# EAGLE schematic Yocto v2.007 (EAGLE 6.1), part 2 of 3
## Sheet 11 of 18: HT
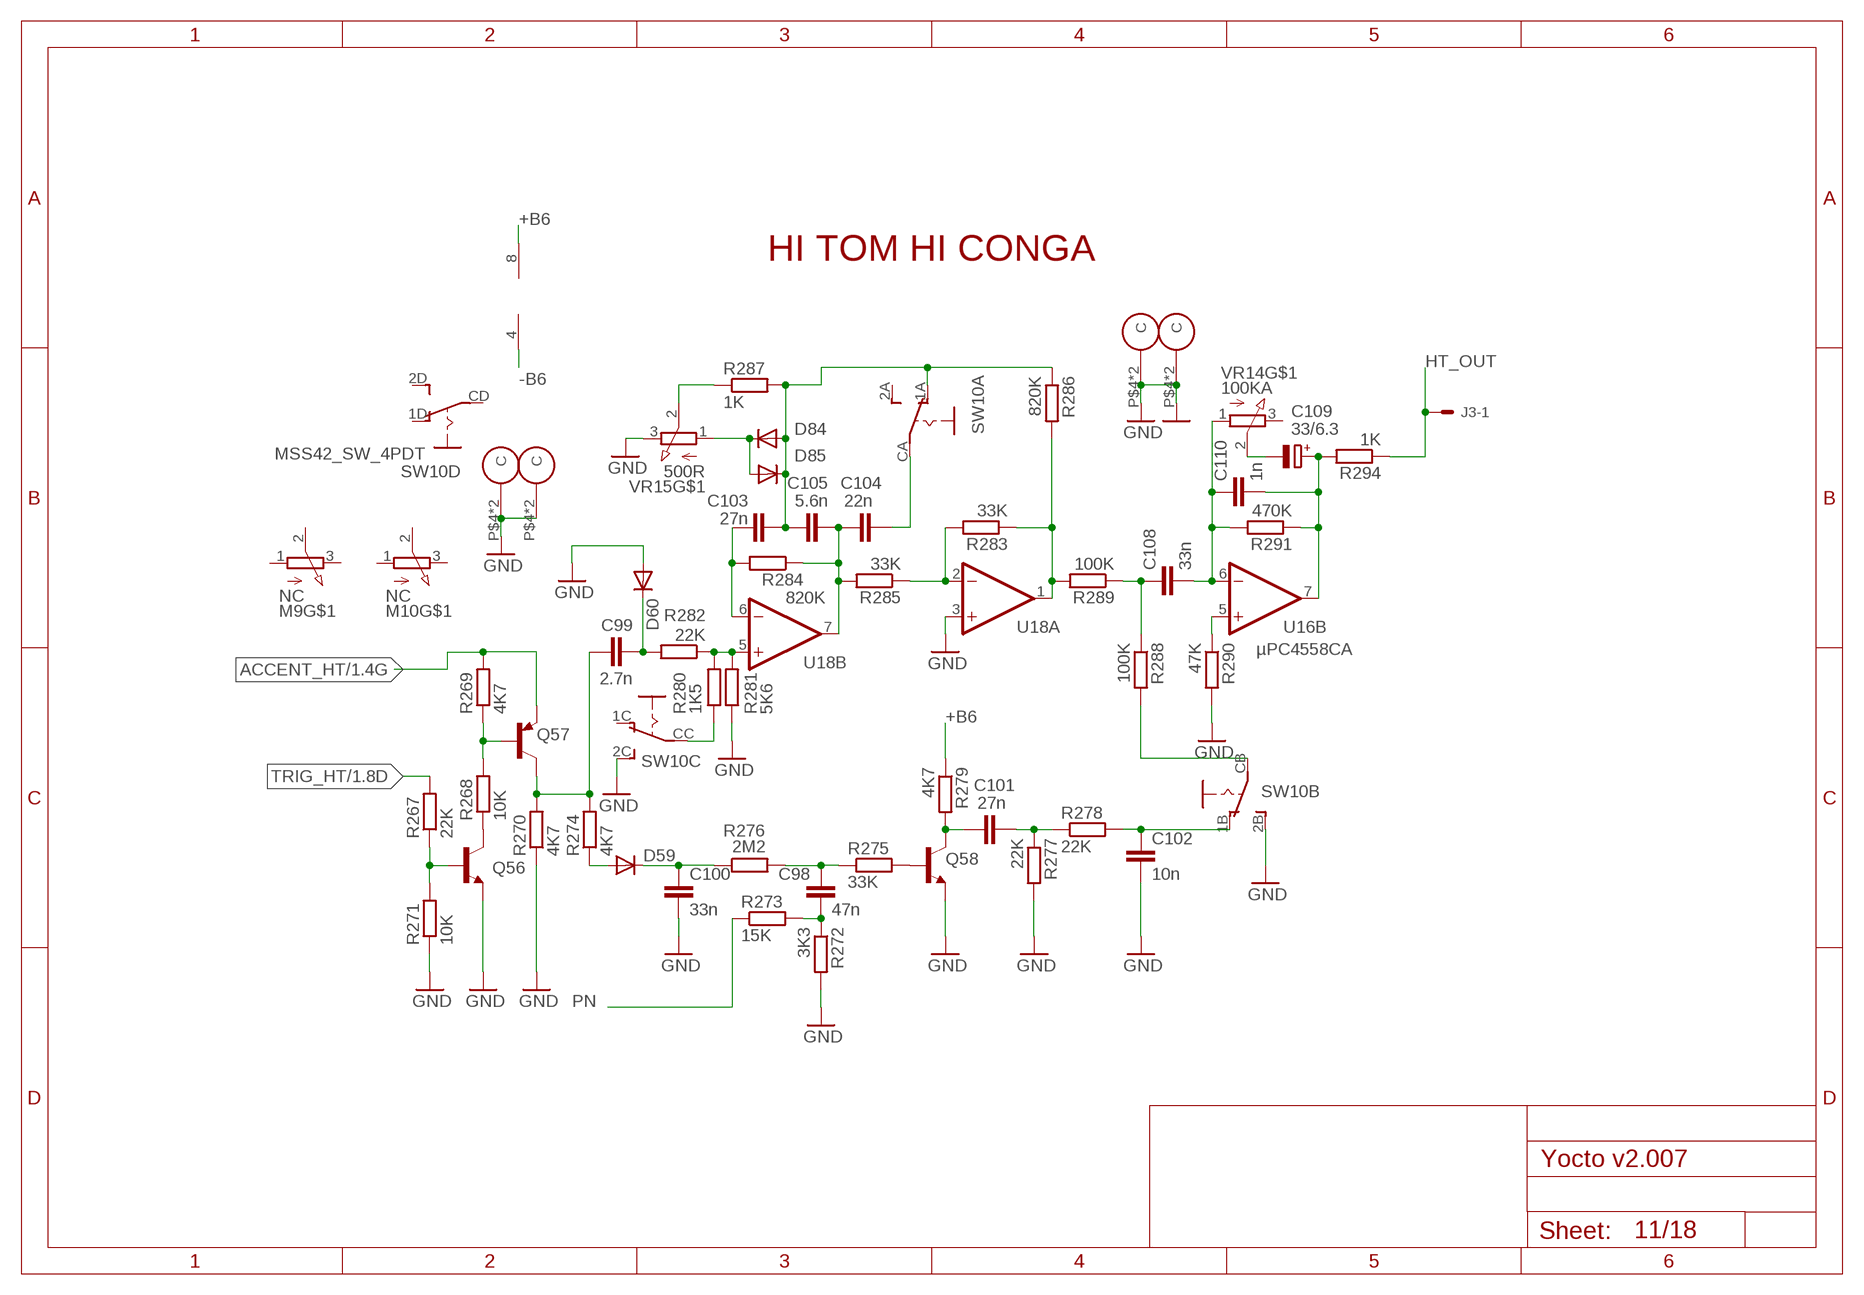
[diagram p11: schematic, sheet 11]

### Parts
C98  47n  C-EU050-025X075  [C050-025X075]
C99  2.7n  C-EU050-025X075  [C050-025X075]
C100  33n  C-EU050-025X075  [C050-025X075]
C101  27n  C-EU050-025X075  [C050-025X075]
C102  10n  C-EU050-025X075  [C050-025X075]
C103  27n  C-EU050-025X075  [C050-025X075]
C104  22n  C-EU050-025X075  [C050-025X075]
C105  5.6n  C-EU050-025X075  [C050-025X075]
C108  33n  C-EU050-025X075  [C050-025X075]
C109  33/6.3  CPOL-EUE2-5  [E2-5]
C110  1n  C-EU050-025X075  [C050-025X075]
D59  1N4148  [DO35-7C]
D60  1N4148  [DO35-7C]
D84  1N34  1N4148  [DO35-7C]
D85  1N34  1N4148  [DO35-7C]
J3  22-27-2041-04  [6410-04]
M9  NC  POT_8089MM  [R0903N]
M10  NC  POT_8089MM  [R0903N]
Q56  2SC945  [TO-92-ECB-PERSO]
Q57  2SA733  [TO-92-ECB-MARKED]
Q58  2SC945  [TO-92-ECB-PERSO]
R267  22K  R-EU_0207/7  [0207/7]
R268  10K  R-EU_0207/7  [0207/7]
R269  4K7  R-EU_0207/7  [0207/7]
R270  4K7  R-EU_0207/7  [0207/7]
R271  10K  R-EU_0207/7  [0207/7]
R272  3K3  R-EU_0207/7  [0207/7]
R273  15K  R-EU_0207/7  [0207/7]
R274  4K7  R-EU_0207/7  [0207/7]
R275  33K  R-EU_0207/7  [0207/7]
R276  2M2  R-EU_0207/7  [0207/7]
R277  22K  R-EU_0207/7  [0207/7]
R278  22K  R-EU_0207/7  [0207/7]
R279  4K7  R-EU_0207/7  [0207/7]
R280  1K5  R-EU_0207/7  [0207/7]
R281  5K6  R-EU_0207/7  [0207/7]
R282  22K  R-EU_0207/7  [0207/7]
R283  33K  R-EU_0207/7  [0207/7]
R284  820K  R-EU_0207/7  [0207/7]
R285  33K  R-EU_0207/7  [0207/7]
R286  820K  R-EU_0207/7  [0207/7]
R287  1K  R-EU_0207/7  [0207/7]
R288  100K  R-EU_0207/7  [0207/7]
R289  100K  R-EU_0207/7  [0207/7]
R290  47K  R-EU_0207/7  [0207/7]
R291  470K  R-EU_0207/7  [0207/7]
R294  1K  R-EU_0207/7  [0207/7]
SW10  MSS42_SW_4PDT  [MSS42_SW_SLIDE]
U18  µPC4558CA  [DIL08]
VR14  100KA  POT_8089MM  [R0903N]
VR15  500R  POT_8089MM  [R0903N]

### Nets
+B6 [power]: R279.1 U18.8(V+) ; also sheet 4
-B6 [power]: U18.4(V-) ; also sheet 4
ACCENT_HT: Q57.E R269.2 ; also sheet 1
GND [GND]: C100.2 C102.2 D60.A M9.P$4(C) M9.P$5(C) M10.P$4(C) M10.P$5(C) Q56.E Q58.E R270.1 R271.1 R272.2 R277.2 R281.1 R290.2 SW10.2B(B:S) SW10.2C(C:S) SW10.P$1(GND) SW10.P$2(GND) SW10.P$3(GND) SW10.P$4(GND) U18.3(A:+IN) VR14.P$4(C) VR14.P$5(C) VR15.3(E) VR15.P$4(C) VR15.P$5(C) ; also sheet 1,2,3,4,5,6,7,8,9,10,12,13,14,15,16,17,18
HT_OUT: J3.1 R294.1
N$141: Q57.B R268.2 R269.1
N$142: Q56.C R268.1
N$143: Q56.B R267.1 R271.2
N$144: C99.1 Q57.C R270.2 R274.2
N$145: D59.A R274.1
N$146: C99.2 D60.C R282.2
N$147 [special]: C103.2 C105.1 D84.A D85.C R286.1 R287.2 SW10.1A(A:O)
N$148: C103.1 R284.2 U18.6(B:-IN)
N$149: C104.1 C105.2 R284.1 R285.2 U18.7(B:OUT)
N$150: D84.C D85.A VR15.1(A)
N$151: R287.1 VR15.2(S)
N$152: R283.2 R285.1 U18.2(A:-IN)
N$153 [special]: R283.1 R286.2 R289.2 U18.1(A:OUT)
N$154: C108.1 R288.1 R289.1
N$155: C108.2 C110.1 R291.2 U16.6(B:-IN) VR14.1(A)
N$156: C109.- VR14.2(S)
N$157: C109.+ C110.2 R291.1 R294.2 U16.7(B:OUT)
N$158: C101.1 Q58.C R279.2
N$161: C102.1 R278.2 SW10.1B(B:O)
N$162: Q58.B R275.2
N$165: C98.2 R272.1 R273.2
N$167: C98.1 R275.1 R276.2
N$168: C100.1 D59.C R276.1
N$169: C104.2 SW10.CA(A:P)
N$170: R288.2 SW10.CB(B:P)
N$171: C101.2 R277.1 R278.1
N$172: R290.1 U16.5(B:+IN)
N$173: R280.2 R281.2 R282.1 U18.5(B:+IN)
N$174: R280.1 SW10.CC(C:P)
PN: R273.1 ; also sheet 6,9,10
TRIG_HT: R267.2 ; also sheet 1
Unconnected: M9.1(A) M9.2(S) M9.3(E) M10.1(A) M10.2(S) M10.3(E) SW10.1C(C:O) SW10.1D(D:O) SW10.2A(A:S) SW10.2D(D:S) SW10.CD(D:P) VR14.3(E)

### Notes on the sheet
- HI TOM HI CONGA

## Sheet 12 of 18: RM
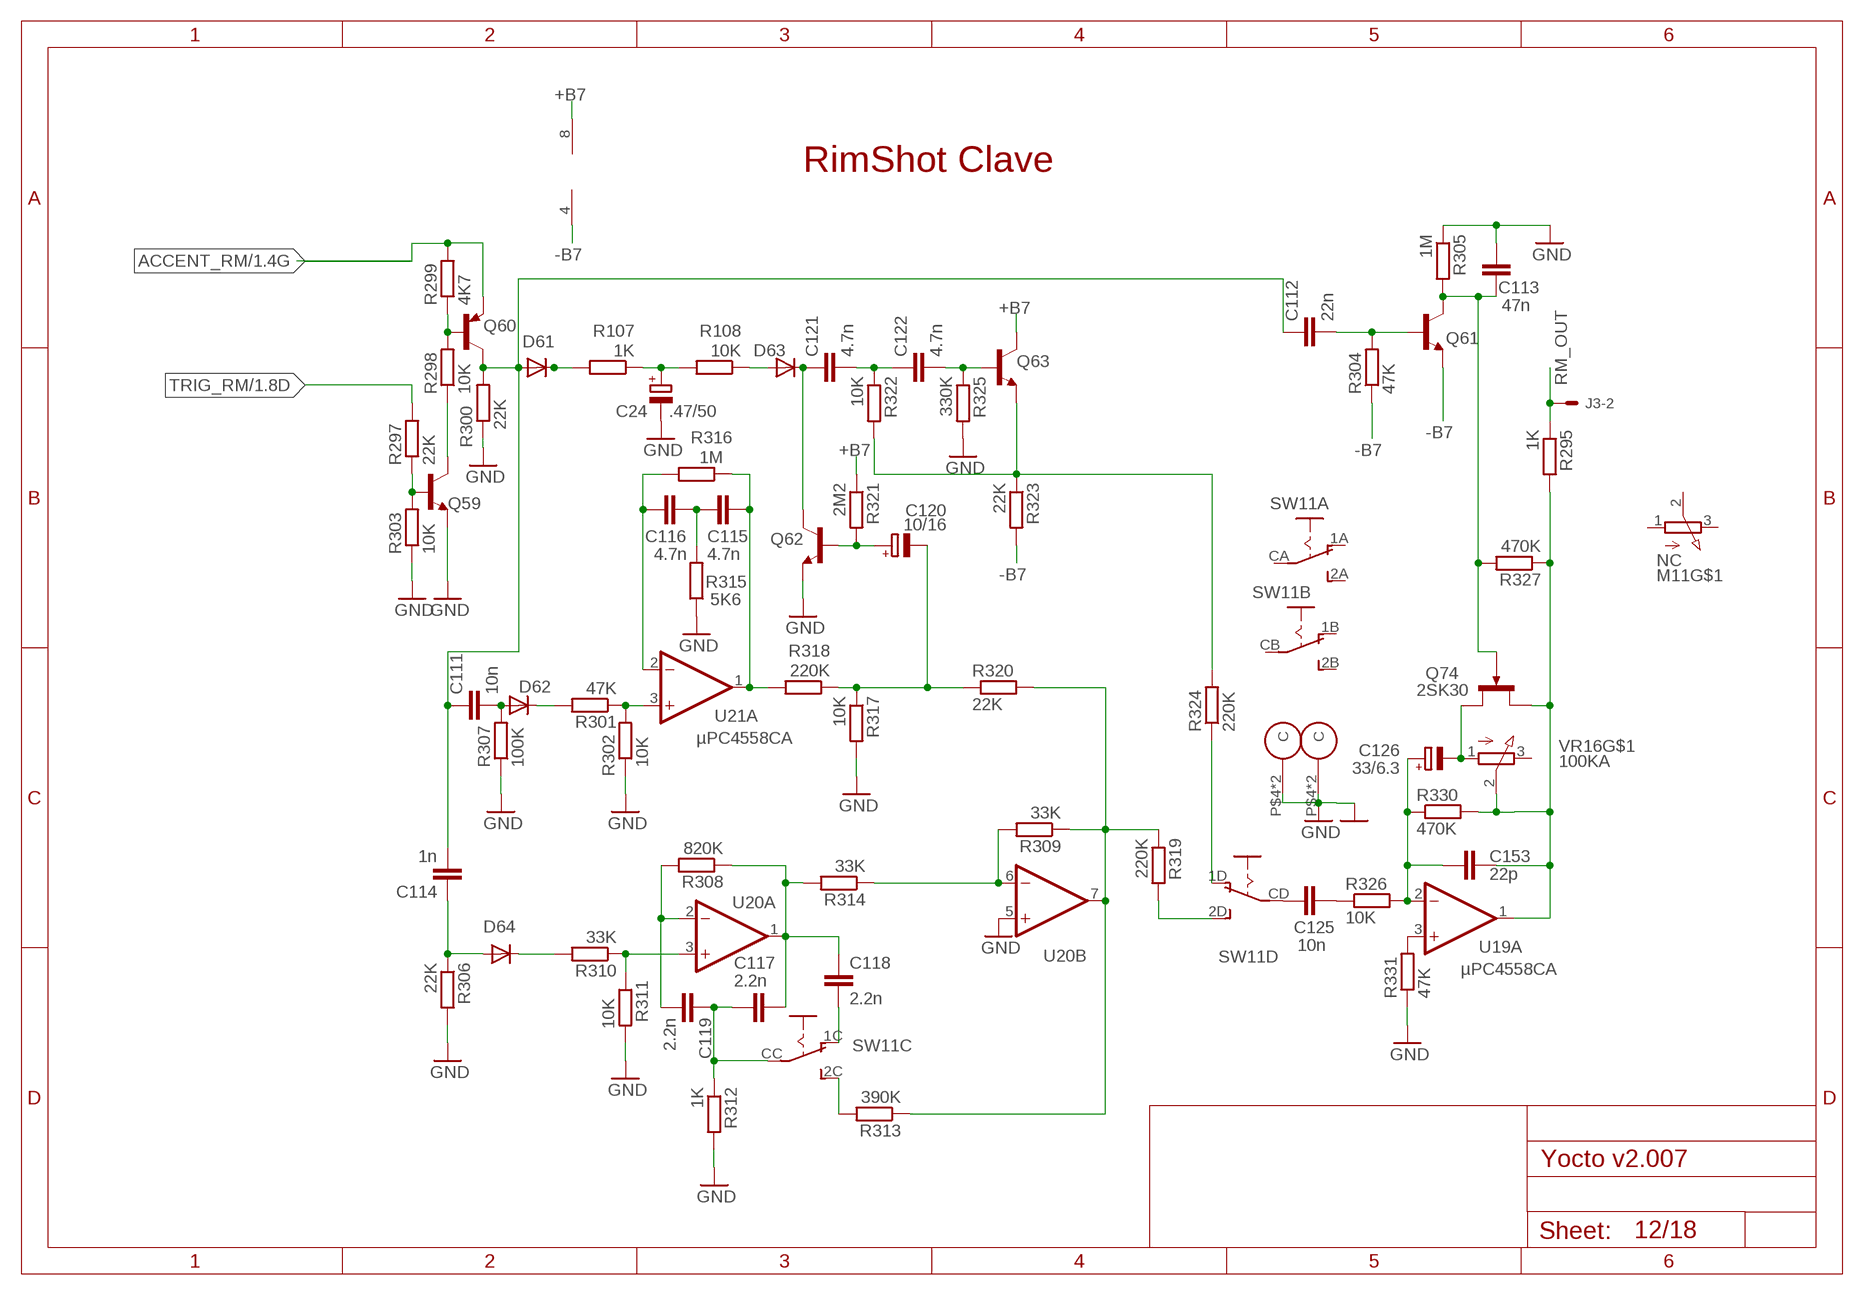
[diagram p12: schematic, sheet 12]

### Parts
C24  .47/50  CPOL-EUE2-5  [E2-5]
C111  10n  C-EU050-025X075  [C050-025X075]
C112  22n  C-EU050-025X075  [C050-025X075]
C113  47n  C-EU050-025X075  [C050-025X075]
C114  1n  C-EU050-025X075  [C050-025X075]
C115  4.7n  C-EU050-025X075  [C050-025X075]
C116  4.7n  C-EU050-025X075  [C050-025X075]
C117  2.2n  C-EU050-025X075  [C050-025X075]
C118  2.2n  C-EU050-025X075  [C050-025X075]
C119  2.2n  C-EU050-025X075  [C050-025X075]
C120  10/16  CPOL-EUE2-5  [E2-5]
C121  4.7n  C-EU050-025X075  [C050-025X075]
C122  4.7n  C-EU050-025X075  [C050-025X075]
C125  10n  C-EU050-025X075  [C050-025X075]
C126  33/6.3  CPOL-EUE2-5  [E2-5]
C153  22p  C-EU025-025X050  [C025-025X050]
D61  1N4148  [DO35-7C]
D62  1N4148  [DO35-7C]
D63  1N4148  [DO35-7C]
D64  1N4148  [DO35-7C]
M11  NC  POT_8089MM  [R0903N]
Q59  2SC945  [TO-92-ECB-PERSO]
Q60  2SA733  [TO-92-ECB-MARKED]
Q61  2SC945  [TO-92-ECB-PERSO]
Q62  2SC945  [TO-92-ECB-PERSO]
Q63  2SC945  [TO-92-ECB-PERSO]
Q74  2SK30  [TO-92-MARKED_FET]
R107  1K  R-EU_0207/7  [0207/7]
R108  10K  R-EU_0207/7  [0207/7]
R295  1K  R-EU_0207/7  [0207/7]
R297  22K  R-EU_0207/7  [0207/7]
R298  10K  R-EU_0207/7  [0207/7]
R299  4K7  R-EU_0207/7  [0207/7]
R300  22K  R-EU_0207/7  [0207/7]
R301  47K  R-EU_0207/7  [0207/7]
R302  10K  R-EU_0207/7  [0207/7]
R303  10K  R-EU_0207/7  [0207/7]
R304  47K  R-EU_0207/7  [0207/7]
R305  1M  R-EU_0207/7  [0207/7]
R306  22K  R-EU_0207/7  [0207/7]
R307  100K  R-EU_0207/7  [0207/7]
R308  820K  R-EU_0207/7  [0207/7]
R309  33K  R-EU_0207/7  [0207/7]
R310  33K  R-EU_0207/7  [0207/7]
R311  10K  R-EU_0207/7  [0207/7]
R312  1K  R-EU_0207/7  [0207/7]
R313  390K  R-EU_0207/7  [0207/7]
R314  33K  R-EU_0207/7  [0207/7]
R315  5K6  R-EU_0207/7  [0207/7]
R316  1M  R-EU_0207/7  [0207/7]
R317  10K  R-EU_0207/7  [0207/7]
R318  220K  R-EU_0207/7  [0207/7]
R319  220K  R-EU_0207/7  [0207/7]
R320  22K  R-EU_0207/7  [0207/7]
R321  2M2  R-EU_0207/7  [0207/7]
R322  10K  R-EU_0207/7  [0207/7]
R323  22K  R-EU_0207/7  [0207/7]
R324  220K  R-EU_0207/7  [0207/7]
R325  330K  R-EU_0207/7  [0207/7]
R326  10K  R-EU_0207/7  [0207/7]
R327  470K  R-EU_0207/7  [0207/7]
R330  470K  R-EU_0207/7  [0207/7]
R331  47K  R-EU_0207/7  [0207/7]
SW11  MSS42_SW_4PDT  [MSS42_SW_SLIDE]
U19  µPC4558CA  [DIL08]
U20  µPC4558CA  [DIL08]
U21  µPC4558CA  [DIL08]
VR16  100KA  POT_8089MM  [R0903N]

### Nets
+B7 [power]: Q63.C R321.1 U20.8(V+) ; also sheet 4,13
-B7 [power]: Q61.E R304.1 R323.2 U20.4(V-) ; also sheet 4,13
ACCENT_RM: Q60.E R299.2 ; also sheet 1
GND [GND]: C24.- C113.2 M11.P$4(C) M11.P$5(C) Q59.E Q62.E R300.1 R302.1 R303.1 R305.1 R306.2 R307.1 R311.2 R312.2 R315.1 R317.2 R325.2 R331.1 SW11.P$1(GND) SW11.P$2(GND) SW11.P$3(GND) SW11.P$4(GND) U20.5(B:+IN) VR16.P$4(C) VR16.P$5(C) ; also sheet 1,2,3,4,5,6,7,8,9,10,11,13,14,15,16,17,18
N$175: C113.1 Q61.C Q74.G R305.2 R327.2
N$176: C112.2 Q61.B R304.2
N$177: C118.2 SW11.1C(C:O)
N$178: C24.+ R107.1 R108.2
N$179: C153.2 Q74.D R295.2 R327.1 R330.2 U19.1(A:OUT) VR16.2(S)
N$180: C121.1 D63.C Q62.C
N$181: C114.1 D64.A R306.1
N$182: C120.+ Q62.B R321.2
N$183: C111.2 D62.A R307.2
N$184: R331.2 U19.3(A:+IN)
N$185: C125.1 SW11.CD(D:P)
N$306 [special]: R313.2 SW11.2C(C:S)
N$317: Q60.B R298.2 R299.1
N$318: Q59.B R297.1 R303.2
N$319: Q59.C R298.1
N$324: D61.C R107.2
N$326: D63.A R108.1
N$328: C121.2 C122.1 R322.1
N$329: C122.2 Q63.B R325.1
N$330: Q63.E R322.2 R323.1 R324.2
N$332: D62.C R301.2
N$333: R301.1 R302.2 U21.3(A:+IN)
N$336: D64.C R310.2
N$337: R310.1 R311.1 U20.3(A:+IN)
N$338: C117.2 C119.1 R312.1 SW11.CC(C:P)
N$339: C119.2 R308.2 U20.2(A:-IN)
N$340: C117.1 C118.1 R308.1 R314.2 U20.1(A:OUT)
N$343: R309.2 R314.1 U20.6(B:-IN)
N$344: R309.1 R313.1 R319.1 R320.2 U20.7(B:OUT)
N$345: R319.2 SW11.2D(D:S)
N$347: C125.2 R326.1
N$348: C126.+ C153.1 R326.2 R330.1 U19.2(A:-IN)
N$351: C126.- Q74.S VR16.1(A)
N$352: C115.2 C116.1 R315.2
N$353: C116.2 R316.2 U21.2(A:-IN)
N$354: C115.1 R316.1 R318.2 U21.1(A:OUT)
N$355: C120.- R317.1 R318.1 R320.1
N$357: C111.1 C112.1 C114.2 D61.A Q60.C R300.2
N$473: R324.1 SW11.1D(D:O)
RM_OUT: J3.2 R295.1
TRIG_RM: R297.2 ; also sheet 1
Unconnected: M11.1(A) M11.2(S) M11.3(E) SW11.1A(A:O) SW11.1B(B:O) SW11.2A(A:S) SW11.2B(B:S) SW11.CA(A:P) SW11.CB(B:P) VR16.3(E)

### Notes on the sheet
- RimShot Clave

## Sheet 13 of 18: HC
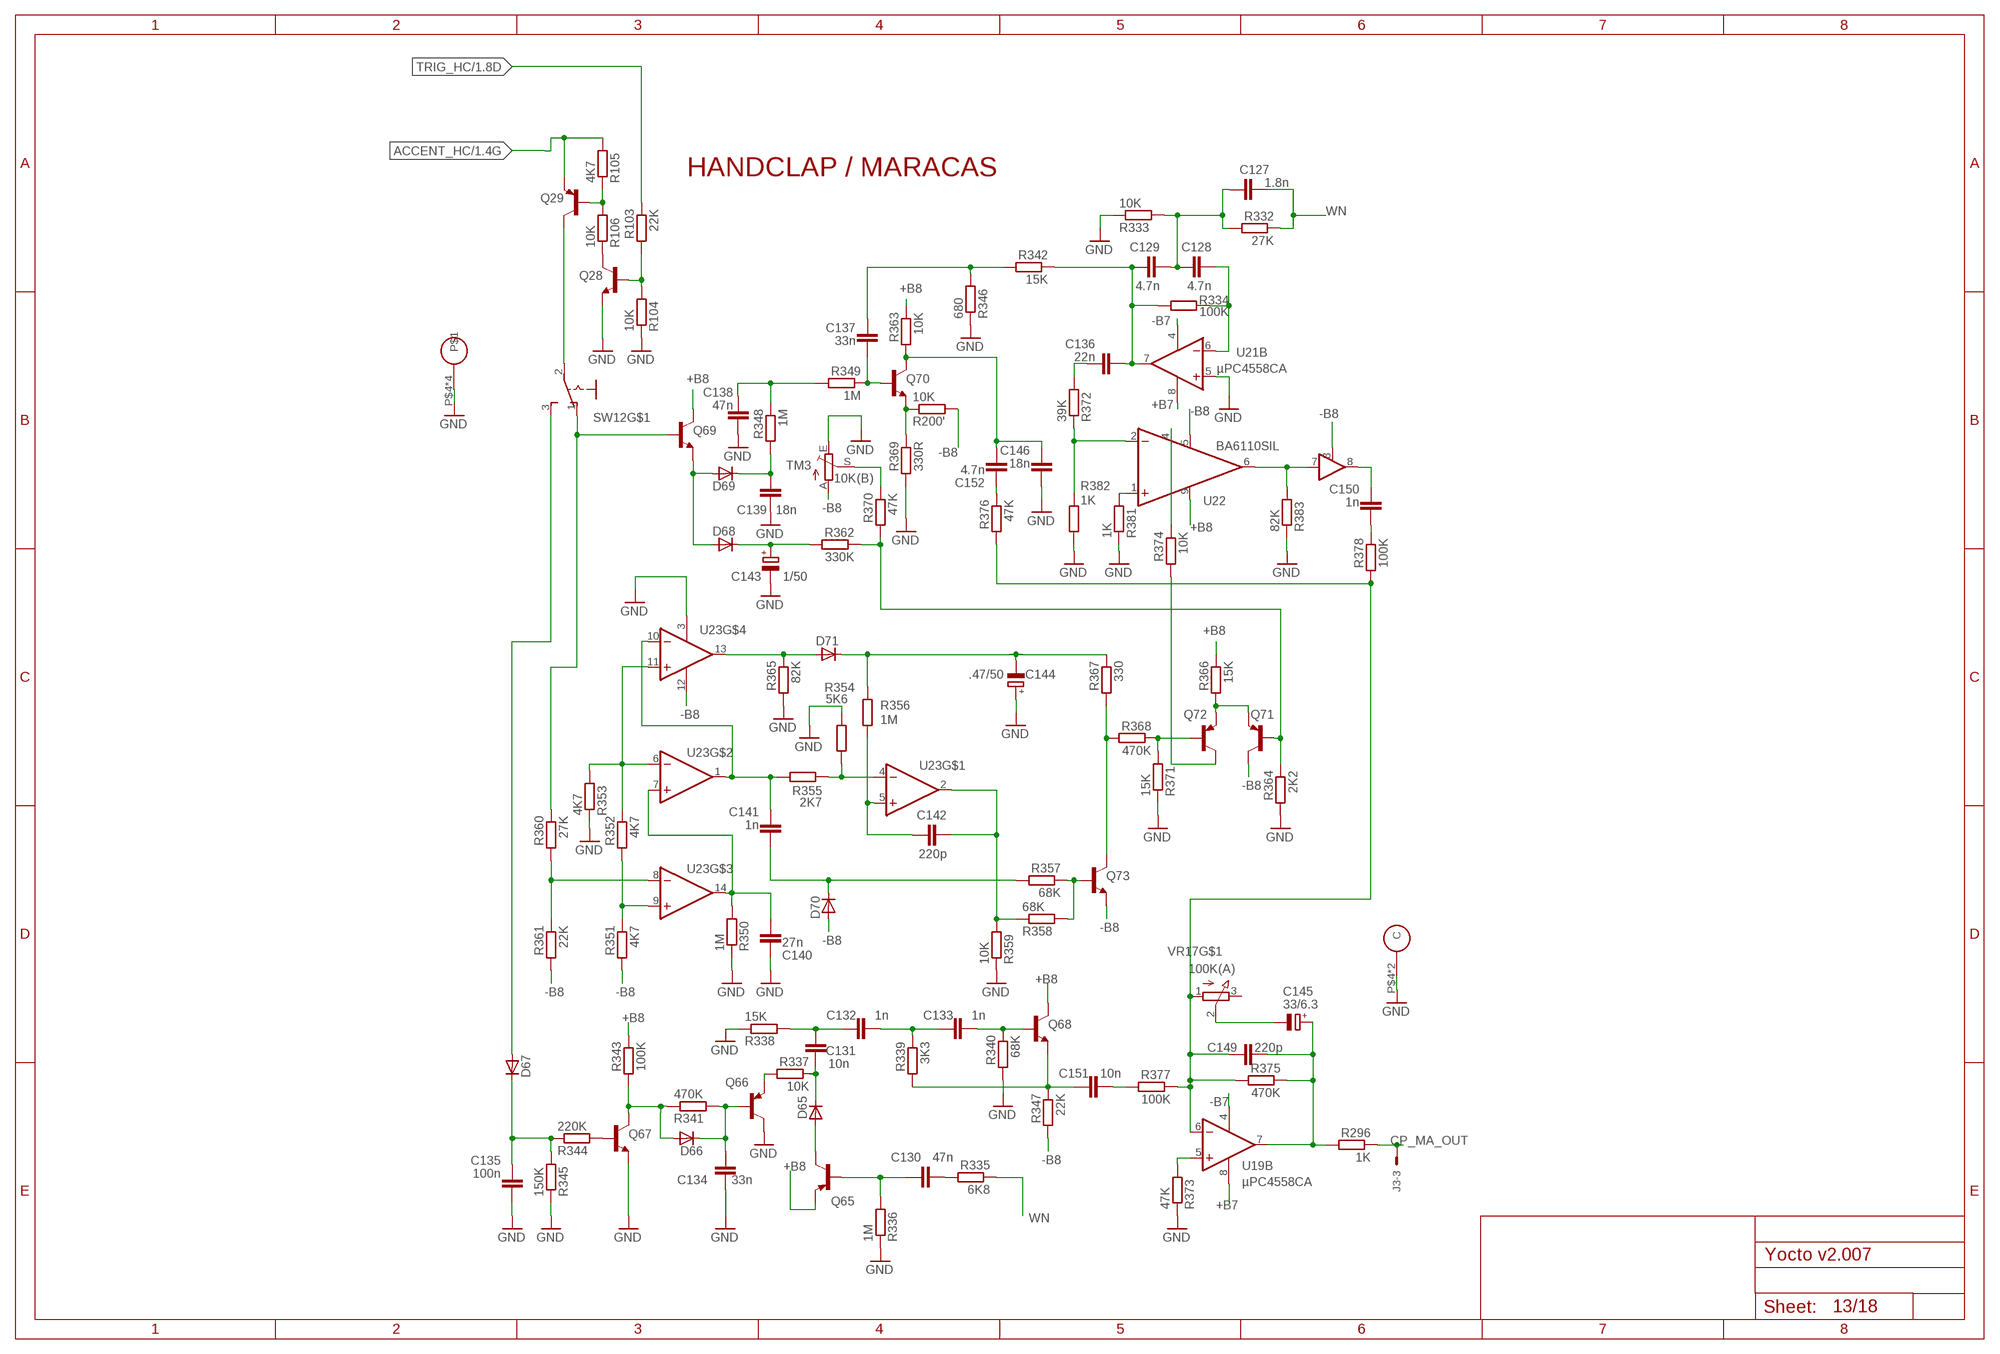
[diagram p13: schematic, sheet 13]

### Parts
C127  1.8n  C-EU050-025X075  [C050-025X075]
C128  4.7n  C-EU050-025X075  [C050-025X075]
C129  4.7n  C-EU050-025X075  [C050-025X075]
C130  47n  C-EU050-025X075  [C050-025X075]
C131  10n  C-EU050-025X075  [C050-025X075]
C132  1n  C-EU050-025X075  [C050-025X075]
C133  1n  C-EU050-025X075  [C050-025X075]
C134  33n  C-EU050-025X075  [C050-025X075]
C135  100n  C-EU050-025X075  [C050-025X075]
C136  22n  C-EU050-025X075  [C050-025X075]
C137  33n  C-EU050-025X075  [C050-025X075]
C138  47n  C-EU050-025X075  [C050-025X075]
C139  18n  C-EU050-025X075  [C050-025X075]
C140  27n  C-EU050-025X075  [C050-025X075]
C141  1n  C-EU050-025X075  [C050-025X075]
C142  220p  C-EU025-025X050  [C025-025X050]
C143  1/50  CPOL-EUE2-5  [E2-5]
C144  .47/50  CPOL-EUE2-5  [E2-5]
C145  33/6.3  CPOL-EUE2-5  [E2-5]
C146  18n  C-EU050-025X075  [C050-025X075]
C149  220p  C-EU025-025X050  [C025-025X050]
C150  1n  C-EU050-025X075  [C050-025X075]
C151  10n  C-EU050-025X075  [C050-025X075]
C152  4.7n  C-EU050-025X075  [C050-025X075]
D65  1N4148  [DO35-7C]
D66  1N4148  [DO35-7C]
D67  1N4148  [DO35-7C]
D68  1N4148  [DO35-7C]
D69  1N4148  [DO35-7C]
D70  1N4148  [DO35-7C]
D71  1N4148  [DO35-7C]
Q28  2SC945  [TO-92-ECB-PERSO]
Q29  2SA733  [TO-92-ECB-MARKED]
Q65  2SA733  [TO-92-ECB-MARKED]
Q66  2SA733  [TO-92-ECB-MARKED]
Q67  2SC945  [TO-92-ECB-PERSO]
Q68  2SC945  [TO-92-ECB-PERSO]
Q69  2SC945  [TO-92-ECB-PERSO]
Q70  2SC945  [TO-92-ECB-PERSO]
Q71  2SA733  [TO-92-ECB-MARKED]
Q72  2SA733  [TO-92-ECB-MARKED]
Q73  2SC945  [TO-92-ECB-PERSO]
R103  22K  R-EU_0207/7  [0207/7]
R104  10K  R-EU_0207/7  [0207/7]
R105  4K7  R-EU_0207/7  [0207/7]
R106  10K  R-EU_0207/7  [0207/7]
R200'  10K  R-EU_0207/7  [0207/7]
R296  1K  R-EU_0207/7  [0207/7]
R332  27K  R-EU_0207/7  [0207/7]
R333  10K  R-EU_0207/7  [0207/7]
R334  100K  R-EU_0207/7  [0207/7]
R335  6K8  R-EU_0207/7  [0207/7]
R336  1M  R-EU_0207/7  [0207/7]
R337  10K  R-EU_0207/7  [0207/7]
R338  15K  R-EU_0207/7  [0207/7]
R339  3K3  R-EU_0207/7  [0207/7]
R340  68K  R-EU_0207/7  [0207/7]
R341  470K  R-EU_0207/7  [0207/7]
R342  15K  R-EU_0207/7  [0207/7]
R343  100K  R-EU_0207/7  [0207/7]
R344  220K  R-EU_0207/7  [0207/7]
R345  150K  R-EU_0207/7  [0207/7]
R346  680  R-EU_0207/7  [0207/7]
R347  22K  R-EU_0207/7  [0207/7]
R348  1M  R-EU_0207/7  [0207/7]
R349  1M  R-EU_0207/7  [0207/7]
R350  1M  R-EU_0207/7  [0207/7]
R351  4K7  R-EU_0207/7  [0207/7]
R352  4K7  R-EU_0207/7  [0207/7]
R353  4K7  R-EU_0207/7  [0207/7]
R354  5K6  R-EU_0207/7  [0207/7]
R355  2K7  R-EU_0207/7  [0207/7]
R356  1M  R-EU_0207/7  [0207/7]
R357  68K  R-EU_0207/7  [0207/7]
R358  68K  R-EU_0207/7  [0207/7]
R359  10K  R-EU_  [0207/7]
R360  27K  R-EU_0207/7  [0207/7]
R361  22K  R-EU_0207/7  [0207/7]
R362  330K  R-EU_0207/7  [0207/7]
R363  10K  R-EU_0207/7  [0207/7]
R364  2K2  R-EU_0207/7  [0207/7]
R365  82K  R-EU_0207/7  [0207/7]
R366  15K  R-EU_0207/7  [0207/7]
R367  330  R-EU_0207/7  [0207/7]
R368  470K  R-EU_0207/7  [0207/7]
R369  330R  R-EU_0207/7  [0207/7]
R370  47K  R-EU_0207/7  [0207/7]
R371  15K  R-EU_0207/7  [0207/7]
R372  39K  R-EU_0207/7  [0207/7]
R373  47K  R-EU_0207/7  [0207/7]
R374  10K  R-EU_0207/7  [0207/7]
R375  470K  R-EU_0207/7  [0207/7]
R376  47K  R-EU_0207/7  [0207/7]
R377  100K  R-EU_0207/7  [0207/7]
R378  100K  R-EU_  [0207/7]
R381  1K  R-EU_0207/7  [0207/7]
R382  1K  R-EU_0207/7  [0207/7]
R383  82K  R-EU_0207/7  [0207/7]
SW12  MSS12  [MSS12_SW_SLIDE]
TM3  10K(B)  TRIM_EU-CT6  [CT6]
U22  BA6110SIL  [SIL09]
U23  AN6912  [DIL14]
VR17  100K(A)  POT_8089MM  [R0903N]

### Nets
+B7 [power]: U19.8(V+) U21.8(V+) ; also sheet 4,12
+B8 [power]: Q65.E Q68.C Q69.C R343.1 R363.1 R366.1 U22.9(V+) ; also sheet 4
-B7 [power]: U19.4(V-) U21.4(V-) ; also sheet 4,12
-B8 [power]: D70.A Q71.C Q73.E R200'.2 R347.2 R351.2 R361.2 TM3.A U22.3 U22.5(V-) U23.12(V-) ; also sheet 4
ACCENT_HC: Q29.E R105.2 ; also sheet 1
CP_MA_OUT: J3.3 R296.1
CPTRIG: Q29.C SW12.2(P)
GND [GND]: C134.2 C135.2 C138.2 C139.1 C140.1 C143.- C144.+ C146.2 Q28.E Q66.C Q67.E R104.1 R333.1 R336.1 R338.1 R340.2 R345.1 R346.1 R350.1 R353.1 R354.2 R359.1 R364.2 R365.2 R369.2 R371.1 R373.1 R381.1 R382.2 R383.1 SW12.P$4 SW12.P$5 SW12.P$6 SW12.P$7 TM3.E U21.5(B:+IN) U23.3(V+) VR17.P$4(C) VR17.P$5(C) ; also sheet 1,2,3,4,5,6,7,8,9,10,11,12,14,15,16,17,18
N$186: Q28.B R103.2 R104.2
N$187: Q29.B R105.1 R106.2
N$188 [special]: Q28.C R106.1
N$189: C137.2 Q70.B R349.1
N$190: C139.2 D69.C R348.2
N$191: Q70.E R200'.1 R369.1
N$192: Q69.B R360.1 SW12.1(O)
N$193: D68.A D69.A Q69.E
N$194: C138.1 R348.1 R349.2
N$195: C146.1 C152.1 Q70.C R363.2
N$196: C143.+ D68.C R362.2
N$197: Q71.B R362.1 R364.1 R370.2
N$198: R370.1 TM3.S
N$199: C129.2 C136.1 R334.2 R342.1 U21.7(B:OUT)
N$200: C137.1 R342.2 R346.2
N$201: C127.2 C128.2 C129.1 R332.2 R333.2
N$202: C128.1 R334.1 U21.6(B:-IN)
N$203: C136.2 R372.2
N$204: R372.1 R382.1 U22.2(-IN)
N$205: C152.2 R376.1
N$206: C150.2 R378.1
N$207: R383.2 U22.6(OUT) U22.7(IN1)
N$208 [special]: C150.1 U22.8(OUT1)
N$209: R352.1 R353.2 U23.6(-IN) U23.11(+IN)
N$210: D71.A R365.1 U23.13(OUT)
N$211: C144.- D71.C R356.1 R367.1
N$212: Q72.B R368.1 R371.2
N$213: Q71.E Q72.E R366.2
N$214: Q72.C R374.2
N$215: Q73.C R367.2 R368.2
N$216: C142.2 R356.2 U23.5(+IN)
N$217: C141.1 R355.2 U23.1(OUT) U23.10(-IN)
N$218: Q73.B R357.1 R358.2
N$219: C141.2 D70.C R357.2
N$220: C142.1 R358.1 R359.2 U23.2(OUT)
N$221: R351.1 R352.2 U23.9(+IN)
N$223: R360.2 R361.1 U23.8(-IN)
N$224: C140.2 R350.2 U23.7(+IN) U23.14(OUT)
N$225: R354.1 R355.1 U23.4(-IN)
N$226: Q67.B R344.2
N$227: D65.A Q65.C
N$228: C135.1 D67.C R344.1 R345.2
N$229: C134.1 D66.C Q66.B R341.2
N$230: Q66.E R337.2
N$232: C131.2 D65.C R337.1
N$234: C131.1 C132.2 R338.2
N$235: C132.1 C133.2 R339.1
N$240: C133.1 Q68.B R340.1
N$275: C151.2 Q68.E R339.2 R347.1
N$277: C130.2 Q65.B R336.2
N$278: C130.1 R335.2
N$279: C151.1 R377.2
N$280: R373.2 U19.5(B:+IN)
N$281 [special]: C149.2 R375.2 R376.2 R377.1 R378.2 U19.6(B:-IN) VR17.1(A)
N$282: C145.+ C149.1 R296.2 R375.1 U19.7(B:OUT)
N$283: C145.- VR17.2(S)
N$284: D67.A SW12.3(S)
N$285: D66.A Q67.C R341.1 R343.2
N$286: R381.2 U22.1(+IN)
N$287: R374.1 U22.4(C)
TRIG_HC: R103.1 ; also sheet 1
WN: C127.1 R332.1 R335.1 ; also sheet 6,8
Unconnected: VR17.3(E)

### Notes on the sheet
- HANDCLAP / MARACAS

## Sheet 14 of 18: CB
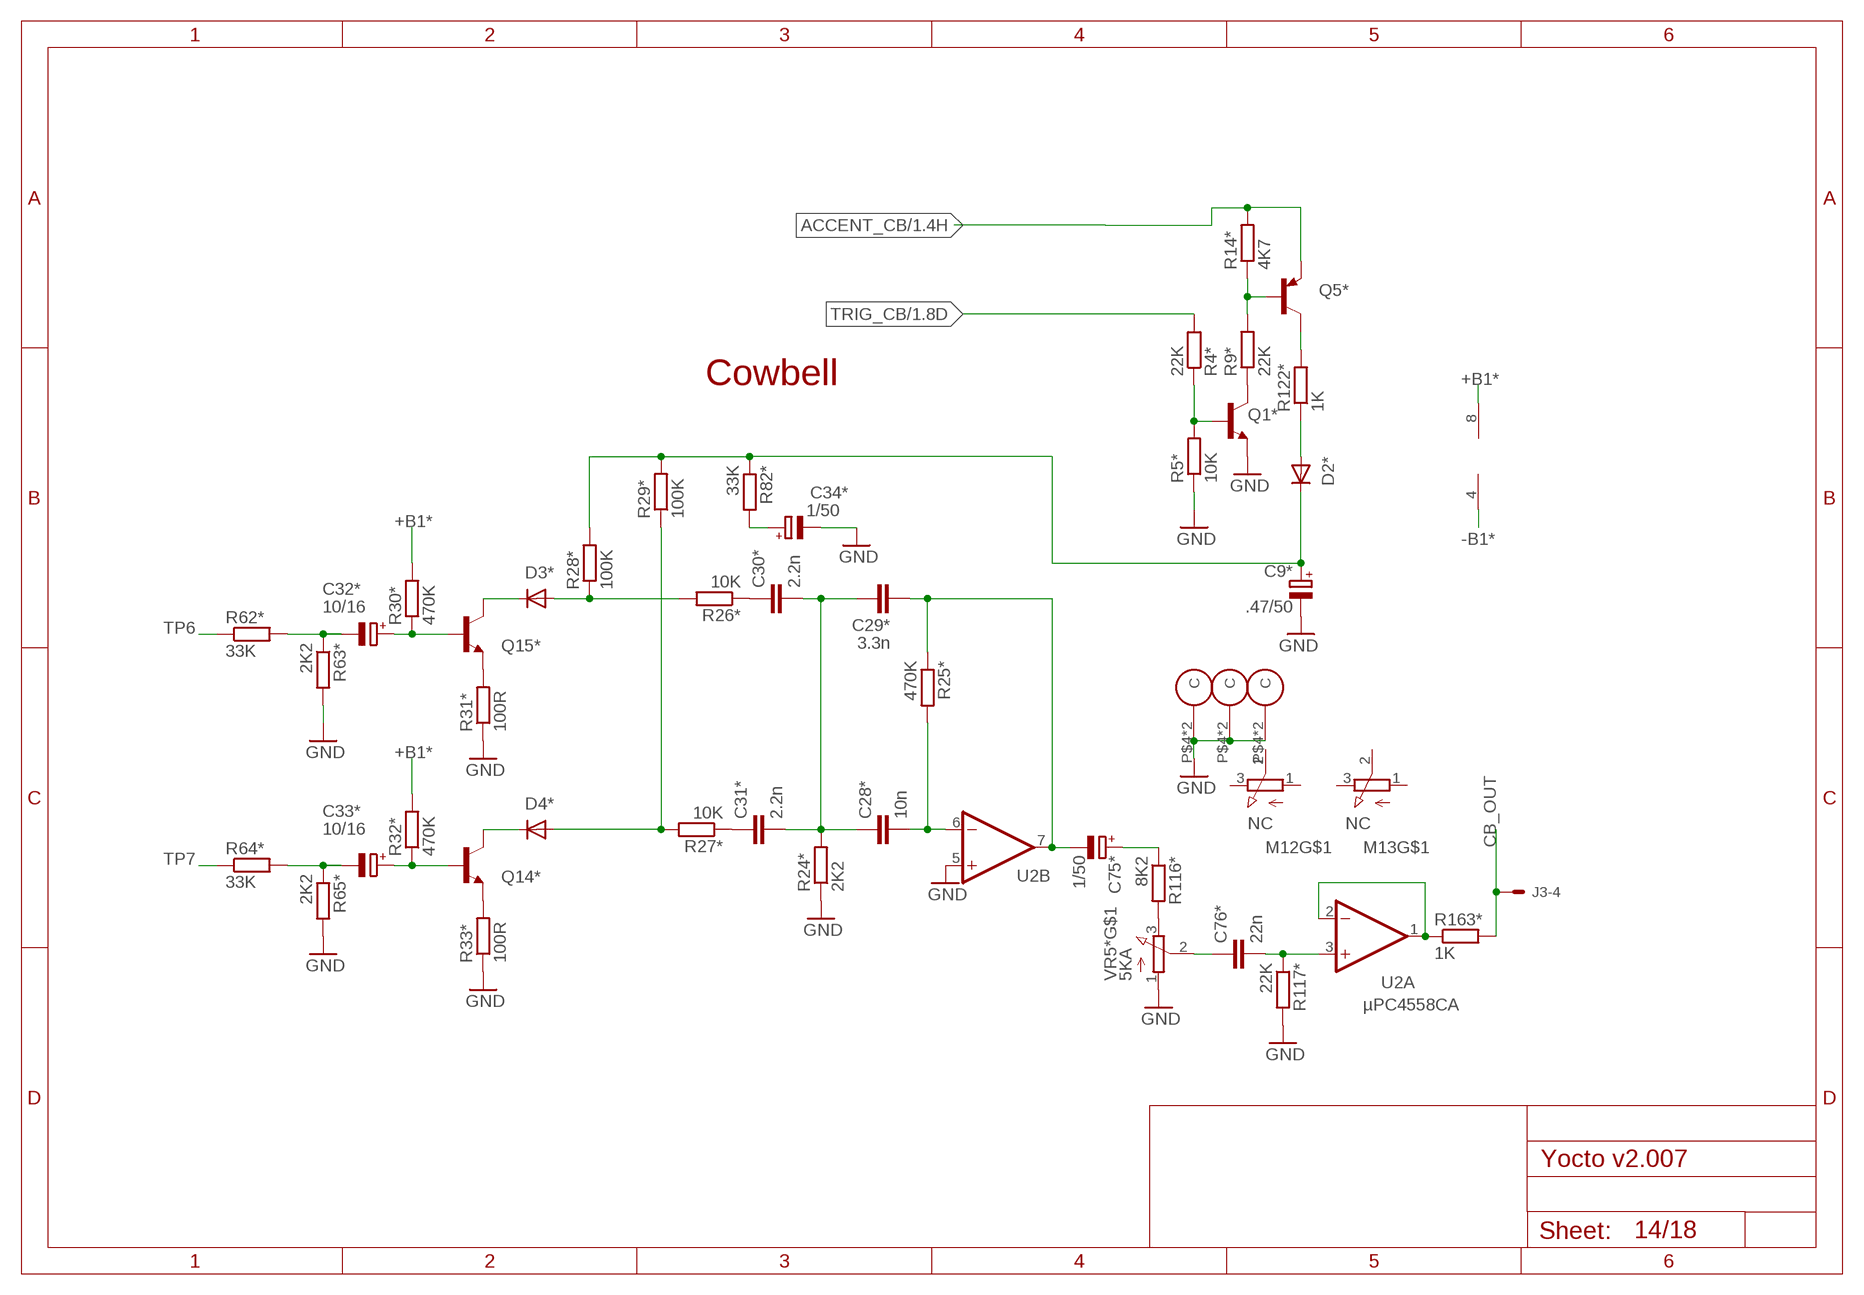
[diagram p14: schematic, sheet 14]

### Parts
C9*  .47/50  CPOL-EUE2-5  [E2-5]
C28*  10n  C-EU050-025X075  [C050-025X075]
C29*  3.3n  C-EU050-025X075  [C050-025X075]
C30*  2.2n  C-EU050-025X075  [C050-025X075]
C31*  2.2n  C-EU050-025X075  [C050-025X075]
C32*  10/16  CPOL-EUE2-5  [E2-5]
C33*  10/16  CPOL-EUE2-5  [E2-5]
C34*  1/50  CPOL-EUE2-5  [E2-5]
C75*  1/50  CPOL-EUE2-5  [E2-5]
C76*  22n  C-EU050-025X075  [C050-025X075]
D2*  1N4148  [DO35-7C]
D3*  1N4148  [DO35-7C]
D4*  1N4148  [DO35-7C]
M12  NC  POT_8089MM  [R0903N]
M13  NC  POT_8089MM  [R0903N]
Q1*  2SC945  [TO-92-ECB-PERSO]
Q5*  2SA733  [TO-92-ECB-MARKED]
Q14*  2SC945  [TO-92-ECB-PERSO]
Q15*  2SC945  [TO-92-ECB-PERSO]
R4*  22K  R-EU_0207/7  [0207/7]
R5*  10K  R-EU_0207/7  [0207/7]
R9*  22K  R-EU_0207/7  [0207/7]
R14*  4K7  R-EU_0207/7  [0207/7]
R24*  2K2  R-EU_0207/7  [0207/7]
R25*  470K  R-EU_0207/7  [0207/7]
R26*  10K  R-EU_  [0207/7]
R27*  10K  R-EU_0207/7  [0207/7]
R28*  100K  R-EU_0207/7  [0207/7]
R29*  100K  R-EU_0207/7  [0207/7]
R30*  470K  R-EU_0207/7  [0207/7]
R31*  100R  R-EU_0207/7  [0207/7]
R32*  470K  R-EU_0207/7  [0207/7]
R33*  100R  R-EU_0207/7  [0207/7]
R62*  33K  R-EU_0207/7  [0207/7]
R63*  2K2  R-EU_0207/7  [0207/7]
R64*  33K  R-EU_0207/7  [0207/7]
R65*  2K2  R-EU_0207/7  [0207/7]
R82*  33K  R-EU_0207/7  [0207/7]
R116*  8K2  R-EU_0207/7  [0207/7]
R117*  22K  R-EU_0207/7  [0207/7]
R122*  1K  R-EU_0207/7  [0207/7]
R163*  1K  R-EU_0207/7  [0207/7]
U2  µPC4558CA  [DIL08]
VR5*  5KA  POT_8089MM  [R0903N]

### Nets
+B1* [power]: R30*.2 R32*.2 U2.8(V+) ; also sheet 4,15
-B1* [power]: U2.4(V-) ; also sheet 4,15
ACCENT_CB: Q5*.E R14*.2 ; also sheet 1
CB_OUT: J3.4 R163*.2
GND [GND]: C9*.- C34*.- M12.P$4(C) M12.P$5(C) M13.P$4(C) M13.P$5(C) Q1*.E R5*.1 R24*.1 R31*.1 R33*.1 R63*.2 R65*.2 R117*.2 U2.5(B:+IN) VR5*.1(A) VR5*.P$4(C) VR5*.P$5(C) ; also sheet 1,2,3,4,5,6,7,8,9,10,11,12,13,15,16,17,18
N$441: Q5*.B R9*.2 R14*.1
N$442: Q1*.C R9*.1
N$443: Q1*.B R4*.1 R5*.2
N$444: C9*.+ D2*.C R28*.2 R29*.2 R82*.1
N$445: Q15*.E R31*.2
N$446: C32*.+ Q15*.B R30*.1
N$447: D3*.C Q15*.C
N$448: D3*.A R26*.2 R28*.1
N$449: Q14*.E R33*.2
N$450: C33*.+ Q14*.B R32*.1
N$451: D4*.C Q14*.C
N$452: D4*.A R27*.2 R29*.1
N$453: C30*.1 R26*.1
N$454: C31*.1 R27*.1
N$455: C28*.1 C29*.1 C30*.2 C31*.2 R24*.2
N$456: C29*.2 C75*.- R25*.1 U2.7(B:OUT)
N$457: C28*.2 R25*.2 U2.6(B:-IN)
N$458: R163*.1 U2.1(A:OUT) U2.2(A:-IN)
N$459: C76*.2 R117*.1 U2.3(A:+IN)
N$460: C76*.1 VR5*.2(S)
N$461: R116*.2 VR5*.3(E)
N$462: C75*.+ R116*.1
N$464: C32*.- R62*.2 R63*.1
N$465: C33*.- R64*.2 R65*.1
N$466: C34*.+ R82*.2
N$467: Q5*.C R122*.2
N$468: D2*.A R122*.1
TP6: R62*.1 ; also sheet 15
TP7: R64*.1 ; also sheet 15
TRIG_CB: R4*.2 ; also sheet 1
Unconnected: M12.1(A) M12.2(S) M12.3(E) M13.1(A) M13.2(S) M13.3(E)

### Notes on the sheet
- Cowbell

## Sheet 15 of 18: CY
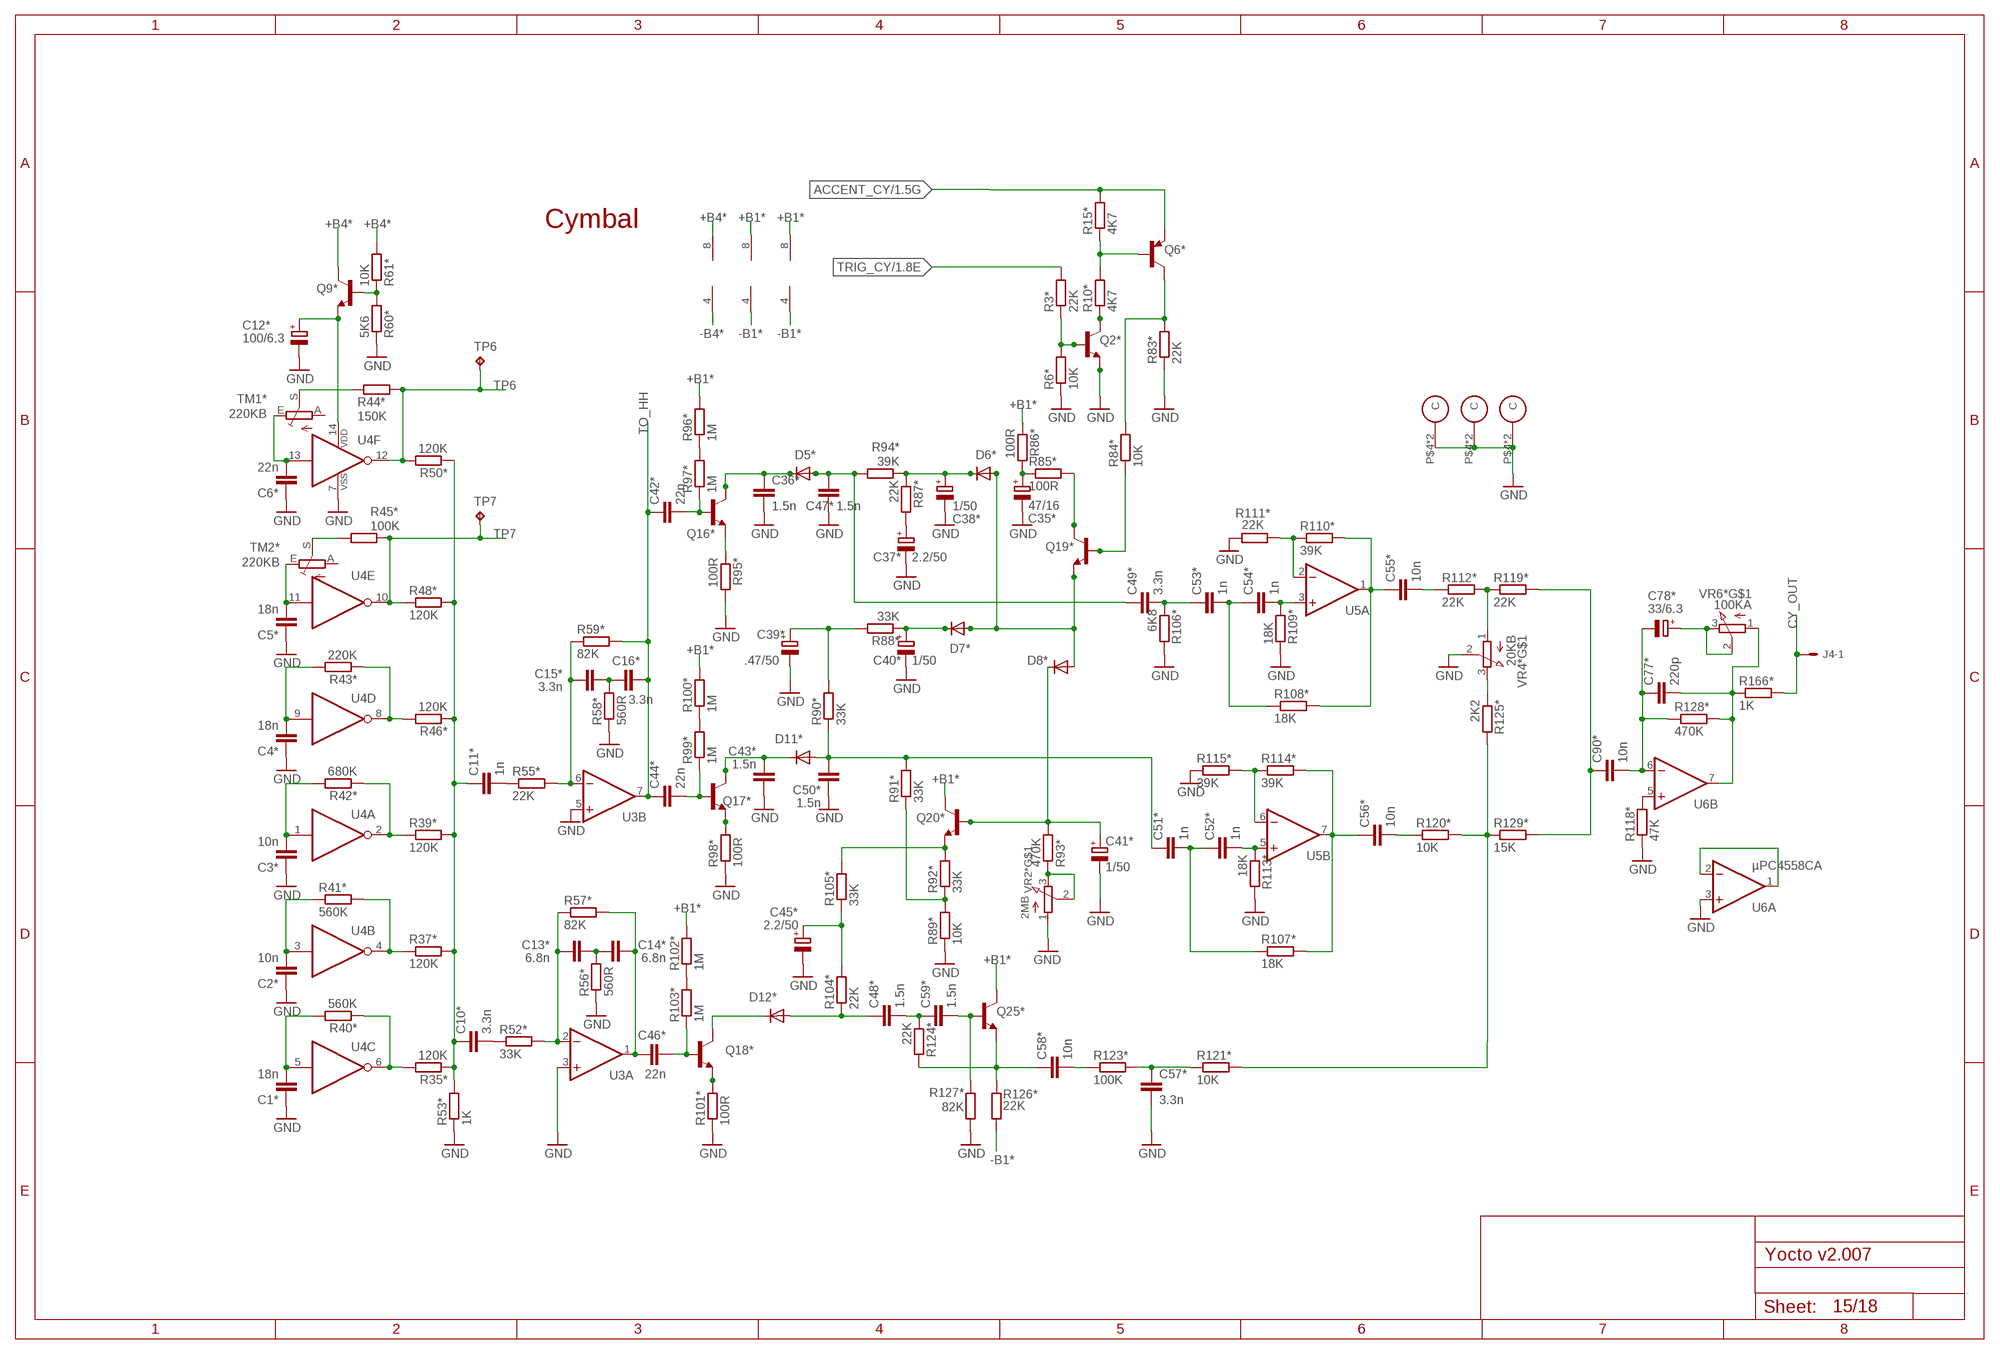
[diagram p15: schematic, sheet 15]

### Parts
C1*  18n  C-EU050-025X075  [C050-025X075]
C2*  10n  C-EU050-025X075  [C050-025X075]
C3*  10n  C-EU050-025X075  [C050-025X075]
C4*  18n  C-EU050-025X075  [C050-025X075]
C5*  18n  C-EU050-025X075  [C050-025X075]
C6*  22n  C-EU050-025X075  [C050-025X075]
C10*  3.3n  C-EU050-025X075  [C050-025X075]
C11*  1n  C-EU050-025X075  [C050-025X075]
C12*  100/6.3  CPOL-EUE2-5  [E2-5]
C13*  6.8n  C-EU050-025X075  [C050-025X075]
C14*  6.8n  C-EU050-025X075  [C050-025X075]
C15*  3.3n  C-EU050-025X075  [C050-025X075]
C16*  3.3n  C-EU050-025X075  [C050-025X075]
C35*  47/16  CPOL-EUE2-5  [E2-5]
C36*  1.5n  C-EU050-025X075  [C050-025X075]
C37*  2.2/50  CPOL-EUE2-5  [E2-5]
C38*  1/50  CPOL-EUE2-5  [E2-5]
C39*  .47/50  CPOL-EUE2-5  [E2-5]
C40*  1/50  CPOL-EUE2-5  [E2-5]
C41*  1/50  CPOL-EUE2-5  [E2-5]
C42*  22n  C-EU050-025X075  [C050-025X075]
C43*  1.5n  C-EU050-025X075  [C050-025X075]
C44*  22n  C-EU050-025X075  [C050-025X075]
C45*  2.2/50  CPOL-EUE2-5  [E2-5]
C46*  22n  C-EU050-025X075  [C050-025X075]
C47*  1.5n  C-EU050-025X075  [C050-025X075]
C48*  1.5n  C-EU050-025X075  [C050-025X075]
C49*  3.3n  C-EU050-025X075  [C050-025X075]
C50*  1.5n  C-EU050-025X075  [C050-025X075]
C51*  1n  C-EU050-025X075  [C050-025X075]
C52*  1n  C-EU050-025X075  [C050-025X075]
C53*  1n  C-EU050-025X075  [C050-025X075]
C54*  1n  C-EU050-025X075  [C050-025X075]
C55*  10n  C-EU050-025X075  [C050-025X075]
C56*  10n  C-EU050-025X075  [C050-025X075]
C57*  3.3n  C-EU050-025X075  [C050-025X075]
C58*  10n  C-EU050-025X075  [C050-025X075]
C59*  1.5n  C-EU050-025X075  [C050-025X075]
C77*  220p  C-EU025-025X050  [C025-025X050]
C78*  33/6.3  CPOL-EUE2-5  [E2-5]
C90*  10n  C-EU050-025X075  [C050-025X075]
D5*  1N4148  [DO35-7C]
D6*  1N4148  [DO35-7C]
D7*  1N4148  [DO35-7C]
D8*  1N4148  [DO35-7C]
D11*  1N4148  [DO35-7C]
D12*  1N4148  [DO35-7C]
J4  22-27-2041-04  [6410-04]
Q2*  2SC945  [TO-92-ECB-PERSO]
Q6*  2SA733  [TO-92-ECB-MARKED]
Q9*  2SC945  [TO-92-ECB-PERSO]
Q16*  2SC945  [TO-92-ECB-PERSO]
Q17*  2SC945  [TO-92-ECB-PERSO]
Q18*  2SC945  [TO-92-ECB-PERSO]
Q19*  2SC945  [TO-92-ECB-PERSO]
Q20*  2SC945  [TO-92-ECB-PERSO]
Q25*  2SC945  [TO-92-ECB-PERSO]
R3*  22K  R-EU_0207/7  [0207/7]
R6*  10K  R-EU_0207/7  [0207/7]
R10*  4K7  R-EU_0207/7  [0207/7]
R15*  4K7  R-EU_0207/7  [0207/7]
R35*  120K  R-EU_0207/7  [0207/7]
R37*  120K  R-EU_0207/7  [0207/7]
R39*  120K  R-EU_0207/7  [0207/7]
R40*  560K  R-EU_0207/7  [0207/7]
R41*  560K  R-EU_0207/7  [0207/7]
R42*  680K  R-EU_0207/7  [0207/7]
R43*  220K  R-EU_0207/7  [0207/7]
R44*  150K  R-EU_0207/7  [0207/7]
R45*  100K  R-EU_0207/7  [0207/7]
R46*  120K  R-EU_0207/7  [0207/7]
R48*  120K  R-EU_0207/7  [0207/7]
R50*  120K  R-EU_0207/7  [0207/7]
R52*  33K  R-EU_0207/7  [0207/7]
R53*  1K  R-EU_0207/7  [0207/7]
R55*  22K  R-EU_0207/7  [0207/7]
R56*  560R  R-EU_0207/7  [0207/7]
R57*  82K  R-EU_0207/7  [0207/7]
R58*  560R  R-EU_0207/7  [0207/7]
R59*  82K  R-EU_0207/7  [0207/7]
R60*  5K6  R-EU_0207/7  [0207/7]
R61*  10K  R-EU_0207/7  [0207/7]
R83*  22K  R-EU_0207/7  [0207/7]
R84*  10K  R-EU_0207/7  [0207/7]
R85*  100R  R-EU_0207/7  [0207/7]
R86*  100R  R-EU_0207/7  [0207/7]
R87*  22K  R-EU_0207/7  [0207/7]
R88*  33K  R-EU_0207/7  [0207/7]
R89*  10K  R-EU_0207/7  [0207/7]
R90*  33K  R-EU_0207/7  [0207/7]
R91*  33K  R-EU_0207/7  [0207/7]
R92*  33K  R-EU_0207/7  [0207/7]
R93*  470K  R-EU_0207/7  [0207/7]
R94*  39K  R-EU_0207/7  [0207/7]
R95*  100R  R-EU_0207/7  [0207/7]
R96*  1M  R-EU_0207/7  [0207/7]
R97*  1M  R-EU_0207/7  [0207/7]
R98*  100R  R-EU_0207/7  [0207/7]
R99*  1M  R-EU_0207/7  [0207/7]
R100*  1M  R-EU_0207/7  [0207/7]
R101*  100R  R-EU_0207/7  [0207/7]
R102*  1M  R-EU_0207/7  [0207/7]
R103*  1M  R-EU_0207/7  [0207/7]
R104*  22K  R-EU_0207/7  [0207/7]
R105*  33K  R-EU_0207/7  [0207/7]
R106*  6K8  R-EU_0207/7  [0207/7]
R107*  18K  R-EU_0207/7  [0207/7]
R108*  18K  R-EU_  [0207/7]
R109*  18K  R-EU_0207/7  [0207/7]
R110*  39K  R-EU_0207/7  [0207/7]
R111*  22K  R-EU_0207/7  [0207/7]
R112*  22K  R-EU_0207/7  [0207/7]
R113*  18K  R-EU_0207/7  [0207/7]
R114*  39K  R-EU_0207/7  [0207/7]
R115*  39K  R-EU_0207/7  [0207/7]
R118*  47K  R-EU_  [0207/7]
R119*  22K  R-EU_0207/7  [0207/7]
R120*  10K  R-EU_0207/7  [0207/7]
R121*  10K  R-EU_0207/7  [0207/7]
R123*  100K  R-EU_0207/7  [0207/7]
R124*  22K  R-EU_0207/7  [0207/7]
R125*  2K2  R-EU_0207/7  [0207/7]
R126*  22K  R-EU_0207/7  [0207/7]
R127*  82K  R-EU_0207/7  [0207/7]
R128*  470K  R-EU_  [0207/7]
R129*  15K  R-EU_0207/7  [0207/7]
R166*  1K  R-EU_0207/7  [0207/7]
TM1*  220KB  TRIM_EU-CT6  [CT6]
TM2*  220KB  TRIM_EU-CT6  [CT6]
TP6  TPB0,8  [B0,8]
TP7  TPB0,8  [B0,8]
U3  µPC4558CA  [DIL08]
U4  4584N  [DIL14]
U5  µPC4558CA  [DIL08]
U6  µPC4558CA  [DIL08]
VR2*  2MB  POT_808  [R1212N]
VR4*  20KB  POT_8089MM  [R0903N]
VR6*  100KA  POT_8089MM  [R0903N]

### Nets
+B1* [power]: Q20*.C Q25*.C R86*.1 R96*.2 R100*.2 R102*.2 U5.8(V+) U6.8(V+) ; also sheet 4,14
+B4* [power]: Q9*.C R61*.2 U3.8(V+) ; also sheet 4
-B1* [power]: R126*.2 U5.4(V-) U6.4(V-) ; also sheet 4,14
-B4* [power]: U3.4(V-) ; also sheet 4
ACCENT_CY: Q6*.E R15*.2 ; also sheet 1
CY_OUT: J4.1 R166*.2
GND [GND]: C1*.1 C2*.1 C3*.1 C4*.1 C5*.1 C6*.1 C12*.- C35*.- C36*.2 C37*.- C38*.- C39*.- C40*.- C41*.- C43*.1 C45*.- C47*.2 C50*.1 C57*.2 Q2*.E R6*.1 R53*.1 R56*.1 R58*.1 R60*.1 R83*.1 R89*.1 R95*.2 R98*.1 R101*.1 R106*.2 R109*.2 R111*.1 R113*.2 R115*.1 R118*.1 R127*.2 U3.3(A:+IN) U3.5(B:+IN) U4.7(P:VSS) U6.3(A:+IN) VR2*.1(A) VR2*.P$4(C) VR2*.P$5(C) VR4*.2(S) VR4*.P$4(C) VR4*.P$5(C) VR6*.P$4(C) VR6*.P$5(C) ; also sheet 1,2,3,4,5,6,7,8,9,10,11,12,13,14,16,17,18
N$291: C78*.+ VR6*.2(S) VR6*.3(E)
N$292: R102*.1 R103*.2
N$293: C58*.1 Q25*.E R124*.2 R126*.1
N$294: R93*.1 VR2*.2(S) VR2*.3(E)
N$295: R99*.2 R100*.1
N$296: R96*.1 R97*.2
N$297: R118*.2 U6.5(B:+IN)
N$298: C1*.2 R40*.2 U4.5(C:I)
N$299: C2*.2 R41*.1 U4.3(B:I)
N$300: C3*.2 R42*.2 U4.1(A:I)
N$301: C4*.2 R43*.2 U4.9(D:I)
N$302: C5*.2 TM2*.E U4.11(E:I)
N$303: C6*.2 TM1*.E U4.13(F:I)
N$304: R35*.2 R40*.1 U4.6(C:O)
N$305: R37*.1 R41*.2 U4.4(B:O)
N$307: R43*.1 R46*.2 U4.8(D:O)
N$308: R45*.1 TM2*.S
N$309: R44*.1 TM1*.S
N$310: C12*.+ Q9*.E U4.14(P:VDD)
N$311: Q9*.B R60*.2 R61*.1
N$312: R39*.1 R42*.1 U4.2(A:O)
N$313: C50*.2 C51*.1 D11*.A R90*.1 R91*.2
N$314: Q16*.E R95*.1
N$481: U6.1(A:OUT) U6.2(A:-IN)
N$485: C10*.1 C11*.1 R35*.1 R37*.2 R39*.2 R46*.1 R48*.2 R50*.1 R53*.2
N$495: C11*.2 R55*.1
N$496: C15*.1 R55*.2 R59*.1 U3.6(B:-IN)
N$498: C44*.2 Q17*.B R99*.1
N$499: Q17*.E R98*.2
N$500: C43*.2 D11*.C Q17*.C
N$501: C39*.+ R88*.2 R90*.2
N$502: C10*.2 R52*.1
N$503: C13*.1 R52*.2 R57*.1 U3.2(A:-IN)
N$504: C14*.2 C46*.1 R57*.2 U3.1(A:OUT)
N$505: C46*.2 Q18*.B R103*.1
N$506: Q18*.E R101*.2
N$507: D12*.C Q18*.C
N$508: C48*.1 D12*.A R104*.1
N$510: C40*.+ D7*.C R88*.1
N$511: C35*.+ R85*.1 R86*.2
N$512: Q19*.C R85*.2
N$513: D6*.A D7*.A D8*.A Q19*.E
N$514: Q19*.B R84*.1
N$515: Q6*.C R83*.2 R84*.2
N$516: Q6*.B R10*.2 R15*.1
N$517: Q2*.B R3*.1 R6*.2
N$519: Q2*.C R10*.1
N$522: C36*.1 D5*.C Q16*.C
N$523: C47*.1 C49*.1 D5*.A R94*.2
N$524: C42*.2 Q16*.B R97*.1
N$526: C37*.+ R87*.2
N$527: Q20*.E R92*.2 R105*.2
N$528: R89*.2 R91*.1 R92*.1
N$529: C41*.+ D8*.C Q20*.B R93*.2
N$530: C49*.2 C53*.1 R106*.1
N$531: C54*.2 R109*.1 U5.3(A:+IN)
N$532: R112*.2 R119*.1 VR4*.1(A)
N$533: C55*.1 R108*.2 R110*.2 U5.1(A:OUT)
N$534: C53*.2 C54*.1 R108*.1
N$535: R110*.1 R111*.2 U5.2(A:-IN)
N$536: C55*.2 R112*.1
N$537: R125*.1 VR4*.3(E)
N$538: C52*.2 R113*.1 U5.5(B:+IN)
N$539: C56*.1 R107*.2 R114*.2 U5.7(B:OUT)
N$540: C51*.2 C52*.1 R107*.1
N$541: R114*.1 R115*.2 U5.6(B:-IN)
N$544: C77*.1 C78*.- C90*.2 R128*.1 U6.6(B:-IN)
N$546: C77*.2 R128*.2 R166*.1 U6.7(B:OUT) VR6*.1(A)
N$547: C56*.2 R120*.1
N$548: R120*.2 R121*.2 R125*.2 R129*.1
N$549: C90*.1 R119*.2 R129*.2
N$550: C48*.2 C59*.1 R124*.1
N$551: C59*.2 Q25*.B R127*.1
N$553: C58*.2 R123*.1
N$554: C57*.1 R121*.1 R123*.2
N$556: C15*.2 C16*.1 R58*.2
N$557: C13*.2 C14*.1 R56*.2
N$558: C45*.+ R104*.2 R105*.1
N$561: C38*.+ D6*.C R87*.1 R94*.1
TO_HH: C16*.2 C42*.1 C44*.1 R59*.2 U3.7(B:OUT) ; also sheet 16
TP6: R44*.2 R50*.2 TP6.P$1(TP) U4.12(F:O) ; also sheet 14
TP7: R45*.2 R48*.1 TP7.P$1(TP) U4.10(E:O) ; also sheet 14
TRIG_CY: R3*.2 ; also sheet 1
Unconnected: TM1*.A TM2*.A

### Notes on the sheet
- Cymbal

## Sheet 16 of 18: HH
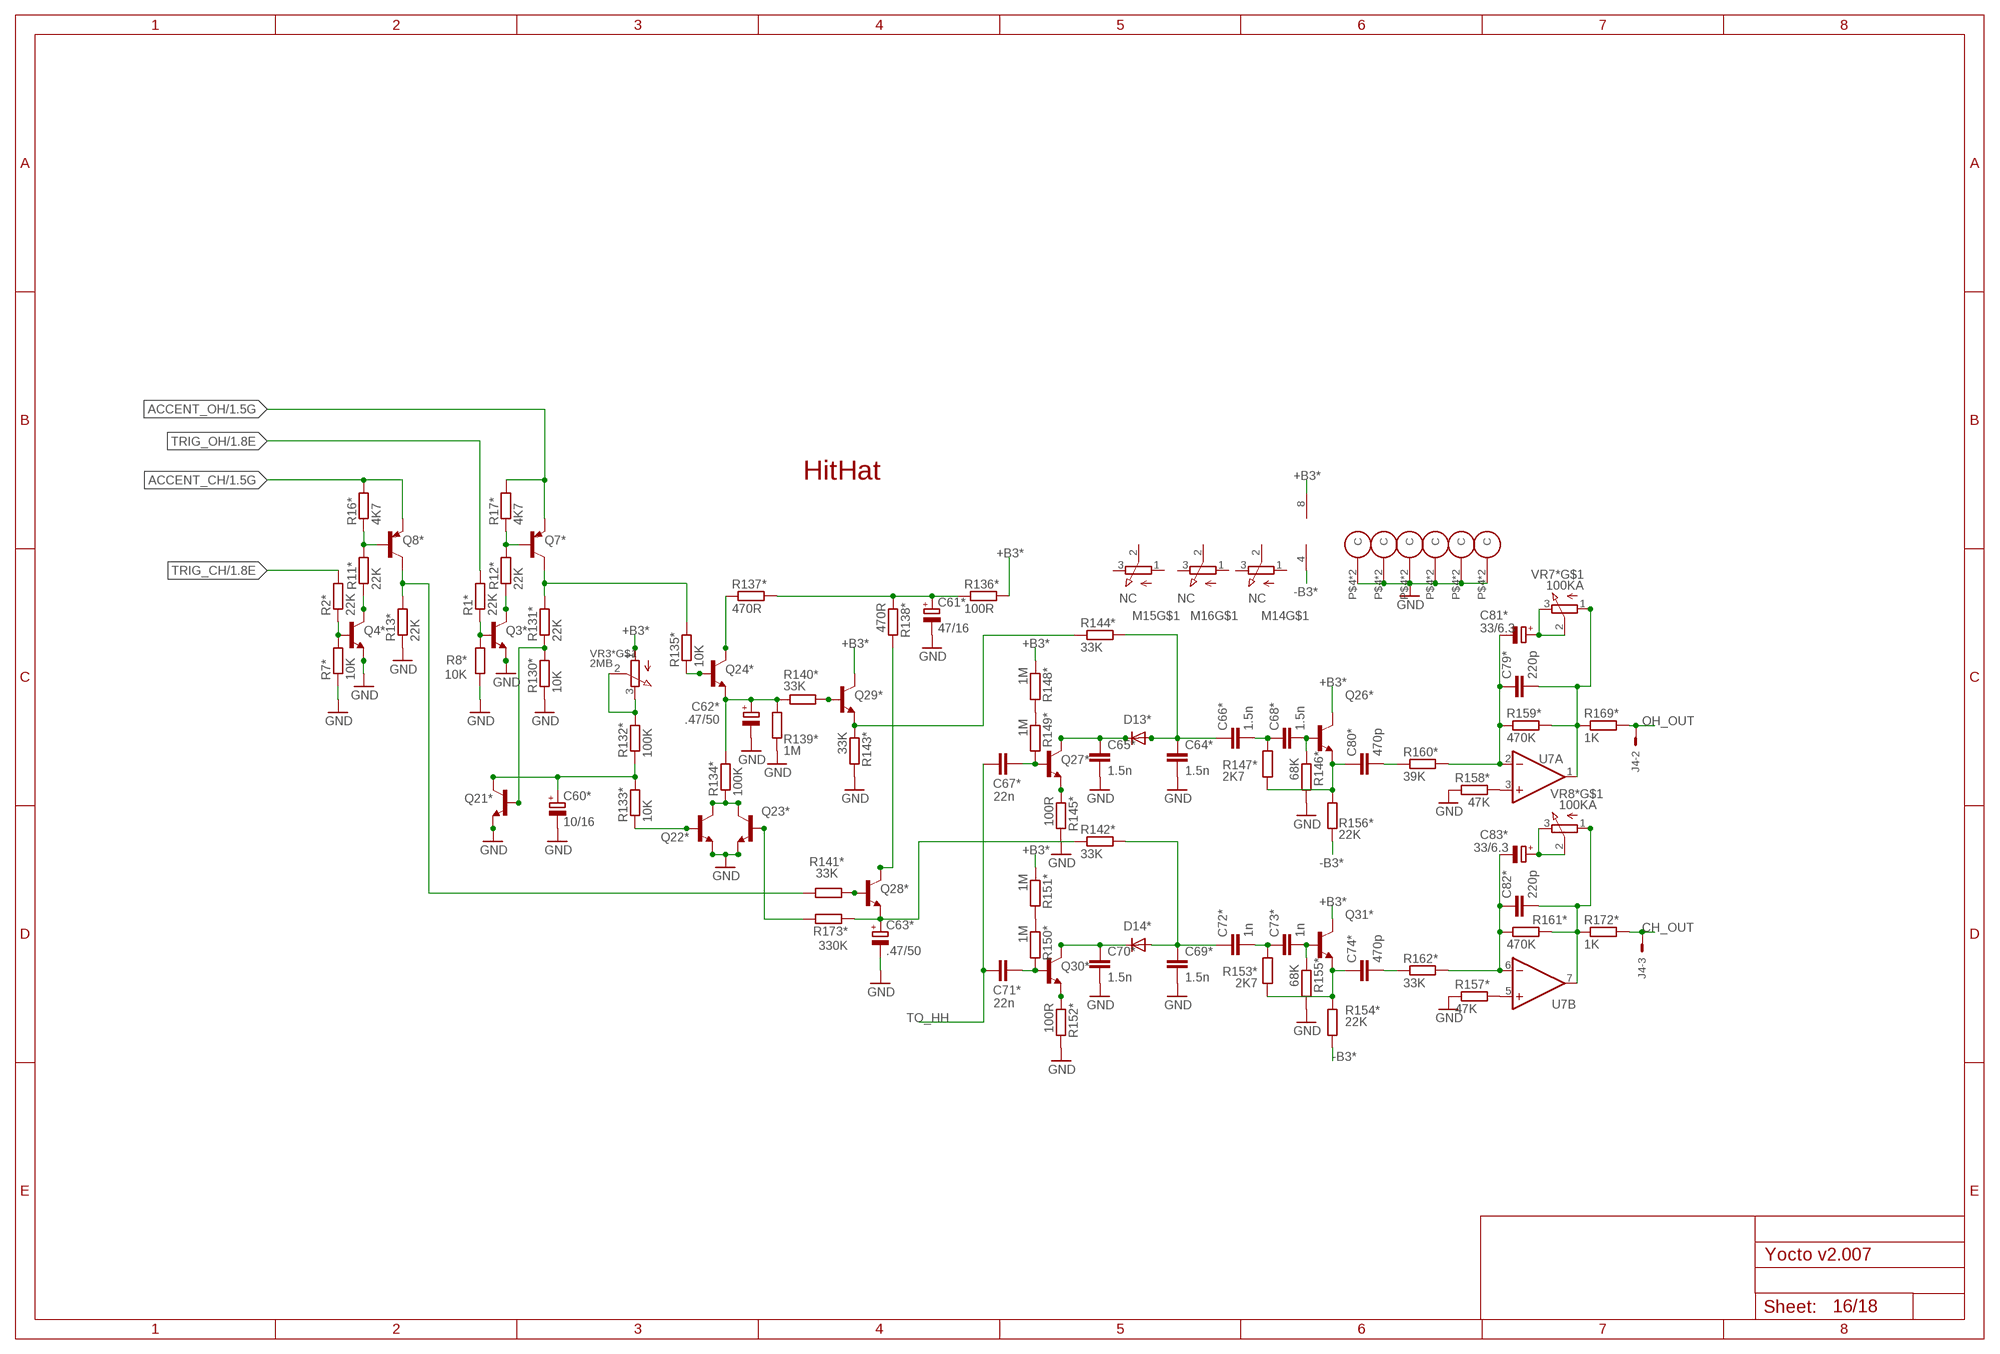
[diagram p16: schematic, sheet 16]

### Parts
C60*  10/16  CPOL-EUE2-5  [E2-5]
C61*  47/16  CPOL-EUE2-5  [E2-5]
C62*  .47/50  CPOL-EUE2-5  [E2-5]
C63*  .47/50  CPOL-EUE2-5  [E2-5]
C64*  1.5n  C-EU050-025X075  [C050-025X075]
C65*  1.5n  C-EU050-025X075  [C050-025X075]
C66*  1.5n  C-EU050-025X075  [C050-025X075]
C67*  22n  C-EU050-025X075  [C050-025X075]
C68*  1.5n  C-EU050-025X075  [C050-025X075]
C69*  1.5n  C-EU050-025X075  [C050-025X075]
C70*  1.5n  C-EU050-025X075  [C050-025X075]
C71*  22n  C-EU050-025X075  [C050-025X075]
C72*  1n  C-EU050-025X075  [C050-025X075]
C73*  1n  C-EU050-025X075  [C050-025X075]
C74*  470p  C-EU050-025X075  [C050-025X075]
C79*  220p  C-EU025-025X050  [C025-025X050]
C80*  470p  C-EU050-025X075  [C050-025X075]
C81*  33/6.3  CPOL-EUE2-5  [E2-5]
C82*  220p  C-EU025-025X050  [C025-025X050]
C83*  33/6.3  CPOL-EUE2-5  [E2-5]
D13*  1N4148  [DO35-7C]
D14*  1N4148  [DO35-7C]
M14  NC  POT_8089MM  [R0903N]
M15  NC  POT_8089MM  [R0903N]
M16  NC  POT_8089MM  [R0903N]
Q3*  2SC945  [TO-92-ECB-PERSO]
Q4*  2SC945  [TO-92-ECB-PERSO]
Q7*  2SA733  [TO-92-ECB-MARKED]
Q8*  2SA733  [TO-92-ECB-MARKED]
Q21*  2SC945  [TO-92-ECB-PERSO]
Q22*  2SC945  [TO-92-ECB-PERSO]
Q23*  2SC945  [TO-92-ECB-PERSO]
Q24*  2SC945  [TO-92-ECB-PERSO]
Q26*  2SC945  [TO-92-ECB-PERSO]
Q27*  2SC945  [TO-92-ECB-PERSO]
Q28*  2SC945  [TO-92-ECB-PERSO]
Q29*  2SC945  [TO-92-ECB-PERSO]
Q30*  2SC945  [TO-92-ECB-PERSO]
Q31*  2SC945  [TO-92-ECB-PERSO]
R1*  22K  R-EU_0207/7  [0207/7]
R2*  22K  R-EU_0207/7  [0207/7]
R7*  10K  R-EU_0207/7  [0207/7]
R8*  10K  R-EU_0207/7  [0207/7]
R11*  22K  R-EU_0207/7  [0207/7]
R12*  22K  R-EU_0207/7  [0207/7]
R13*  22K  R-EU_0207/7  [0207/7]
R16*  4K7  R-EU_0207/7  [0207/7]
R17*  4K7  R-EU_0207/7  [0207/7]
R130*  10K  R-EU_0207/7  [0207/7]
R131*  22K  R-EU_0207/7  [0207/7]
R132*  100K  R-EU_0207/7  [0207/7]
R133*  10K  R-EU_0207/7  [0207/7]
R134*  100K  R-EU_  [0207/7]
R135*  10K  R-EU_0207/7  [0207/7]
R136*  100R  R-EU_0207/7  [0207/7]
R137*  470R  R-EU_0207/7  [0207/7]
R138*  470R  R-EU_0207/7  [0207/7]
R139*  1M  R-EU_0207/7  [0207/7]
R140*  33K  R-EU_0207/7  [0207/7]
R141*  33K  R-EU_0207/7  [0207/7]
R142*  33K  R-EU_0207/7  [0207/7]
R143*  33K  R-EU_0207/7  [0207/7]
R144*  33K  R-EU_0207/7  [0207/7]
R145*  100R  R-EU_0207/7  [0207/7]
R146*  68K  R-EU_0207/7  [0207/7]
R147*  2K7  R-EU_0207/7  [0207/7]
R148*  1M  R-EU_0207/7  [0207/7]
R149*  1M  R-EU_0207/7  [0207/7]
R150*  1M  R-EU_0207/7  [0207/7]
R151*  1M  R-EU_0207/7  [0207/7]
R152*  100R  R-EU_0207/7  [0207/7]
R153*  2K7  R-EU_0207/7  [0207/7]
R154*  22K  R-EU_0207/7  [0207/7]
R155*  68K  R-EU_0207/7  [0207/7]
R156*  22K  R-EU_0207/7  [0207/7]
R157*  47K  R-EU_0207/7  [0207/7]
R158*  47K  R-EU_0207/7  [0207/7]
R159*  470K  R-EU_0207/7  [0207/7]
R160*  39K  R-EU_0207/7  [0207/7]
R161*  470K  R-EU_0207/7  [0207/7]
R162*  33K  R-EU_0207/7  [0207/7]
R169*  1K  R-EU_0207/7  [0207/7]
R172*  1K  R-EU_0207/7  [0207/7]
R173*  330K  R-EU_0207/7  [0207/7]
U7  µPC4558CA  [DIL08]
VR3*  2MB  POT_808  [R1212N]
VR7*  100KA  POT_8089MM  [R0903N]
VR8*  100KA  POT_8089MM  [R0903N]

### Nets
+B3* [power]: Q26*.C Q29*.C Q31*.C R136*.2 R148*.1 R151*.1 U7.8(V+) VR3*.1(A) ; also sheet 4
-B3* [power]: R154*.2 R156*.2 U7.4(V-) ; also sheet 4
ACCENT_CH: Q8*.E R16*.2 ; also sheet 1
ACCENT_OH: Q7*.E R17*.2 ; also sheet 1
CH_OUT: J4.3 R172*.2
GND [GND]: C60*.- C61*.- C62*.- C63*.- C64*.2 C65*.2 C69*.2 C70*.2 M14.P$4(C) M14.P$5(C) M15.P$4(C) M15.P$5(C) M16.P$4(C) M16.P$5(C) Q3*.E Q4*.E Q21*.E Q22*.E Q23*.E R7*.1 R8*.1 R13*.1 R130*.1 R139*.2 R143*.2 R145*.2 R146*.2 R152*.2 R155*.2 R157*.1 R158*.1 VR3*.P$4(C) VR3*.P$5(C) VR7*.P$4(C) VR7*.P$5(C) VR8*.P$4(C) VR8*.P$5(C) ; also sheet 1,2,3,4,5,6,7,8,9,10,11,12,13,14,15,17,18
N$315: C70*.1 D14*.C Q30*.C
N$316: C73*.2 Q31*.B R155*.1
N$320: C74*.2 R162*.1
N$321: C80*.2 R160*.1
N$322: C79*.1 C81*.- R159*.1 R160*.2 U7.2(A:-IN)
N$323: C79*.2 R159*.2 R169*.1 U7.1(A:OUT) VR7*.1(A)
N$325: C82*.1 C83*.- R161*.1 R162*.2 U7.6(B:-IN)
N$327: C82*.2 R161*.2 R172*.1 U7.7(B:OUT) VR8*.1(A)
N$331: Q21*.B R130*.2 R131*.1
N$334: Q29*.B R140*.2
N$335: C80*.1 Q26*.E R147*.2 R156*.1
N$341: C74*.1 Q31*.E R153*.2 R154*.1
N$342: C81*.+ VR7*.2(S) VR7*.3(E)
N$346: R148*.2 R149*.1
N$349: C64*.1 C66*.1 D13*.A R144*.2
N$350: C69*.1 C72*.1 D14*.A R142*.2
N$356: R150*.1 R151*.2
N$358: R158*.2 U7.3(A:+IN)
N$359: R157*.2 U7.5(B:+IN)
N$360: R132*.2 VR3*.2(S) VR3*.3(E)
N$375: C83*.+ VR8*.2(S) VR8*.3(E)
N$559: Q4*.B R2*.1 R7*.2
N$560: Q8*.B R11*.2 R16*.1
N$562: Q4*.C R11*.1
N$563: Q8*.C R13*.2 R141*.1
N$566: Q3*.B R1*.1 R8*.2
N$567: Q7*.B R12*.2 R17*.1
N$568: Q3*.C R12*.1
N$569: Q7*.C R131*.2 R135*.2
N$571: Q24*.C R137*.1
N$572: Q24*.B R135*.1
N$573: C62*.+ Q24*.E R134*.2 R139*.1 R140*.1
N$574: Q22*.C Q23*.C R134*.1
N$575: Q22*.B R133*.1
N$576: C60*.+ Q21*.C R132*.1 R133*.2
N$577: C61*.+ R136*.1 R137*.2 R138*.1
N$578: Q28*.B R141*.2
N$579: Q28*.C R138*.2
N$580: Q23*.B R173*.2
N$581: C63*.+ Q28*.E R142*.1 R173*.1
N$582: Q29*.E R143*.1 R144*.1
N$583: Q30*.E R152*.1
N$584: Q27*.E R145*.1
N$585: C71*.2 Q30*.B R150*.2
N$586: C67*.2 Q27*.B R149*.2
N$588: C65*.1 D13*.C Q27*.C
N$589: C66*.2 C68*.1 R147*.1
N$590: C72*.2 C73*.1 R153*.1
N$591: C68*.2 Q26*.B R146*.1
OH_OUT: J4.2 R169*.2
TO_HH: C67*.1 C71*.1 ; also sheet 15
TRIG_CH: R2*.2 ; also sheet 1
TRIG_OH: R1*.2 ; also sheet 1
Unconnected: M14.1(A) M14.2(S) M14.3(E) M15.1(A) M15.2(S) M15.3(E) M16.1(A) M16.2(S) M16.3(E)

### Notes on the sheet
- HitHat

## Sheet 17 of 18: PC-2
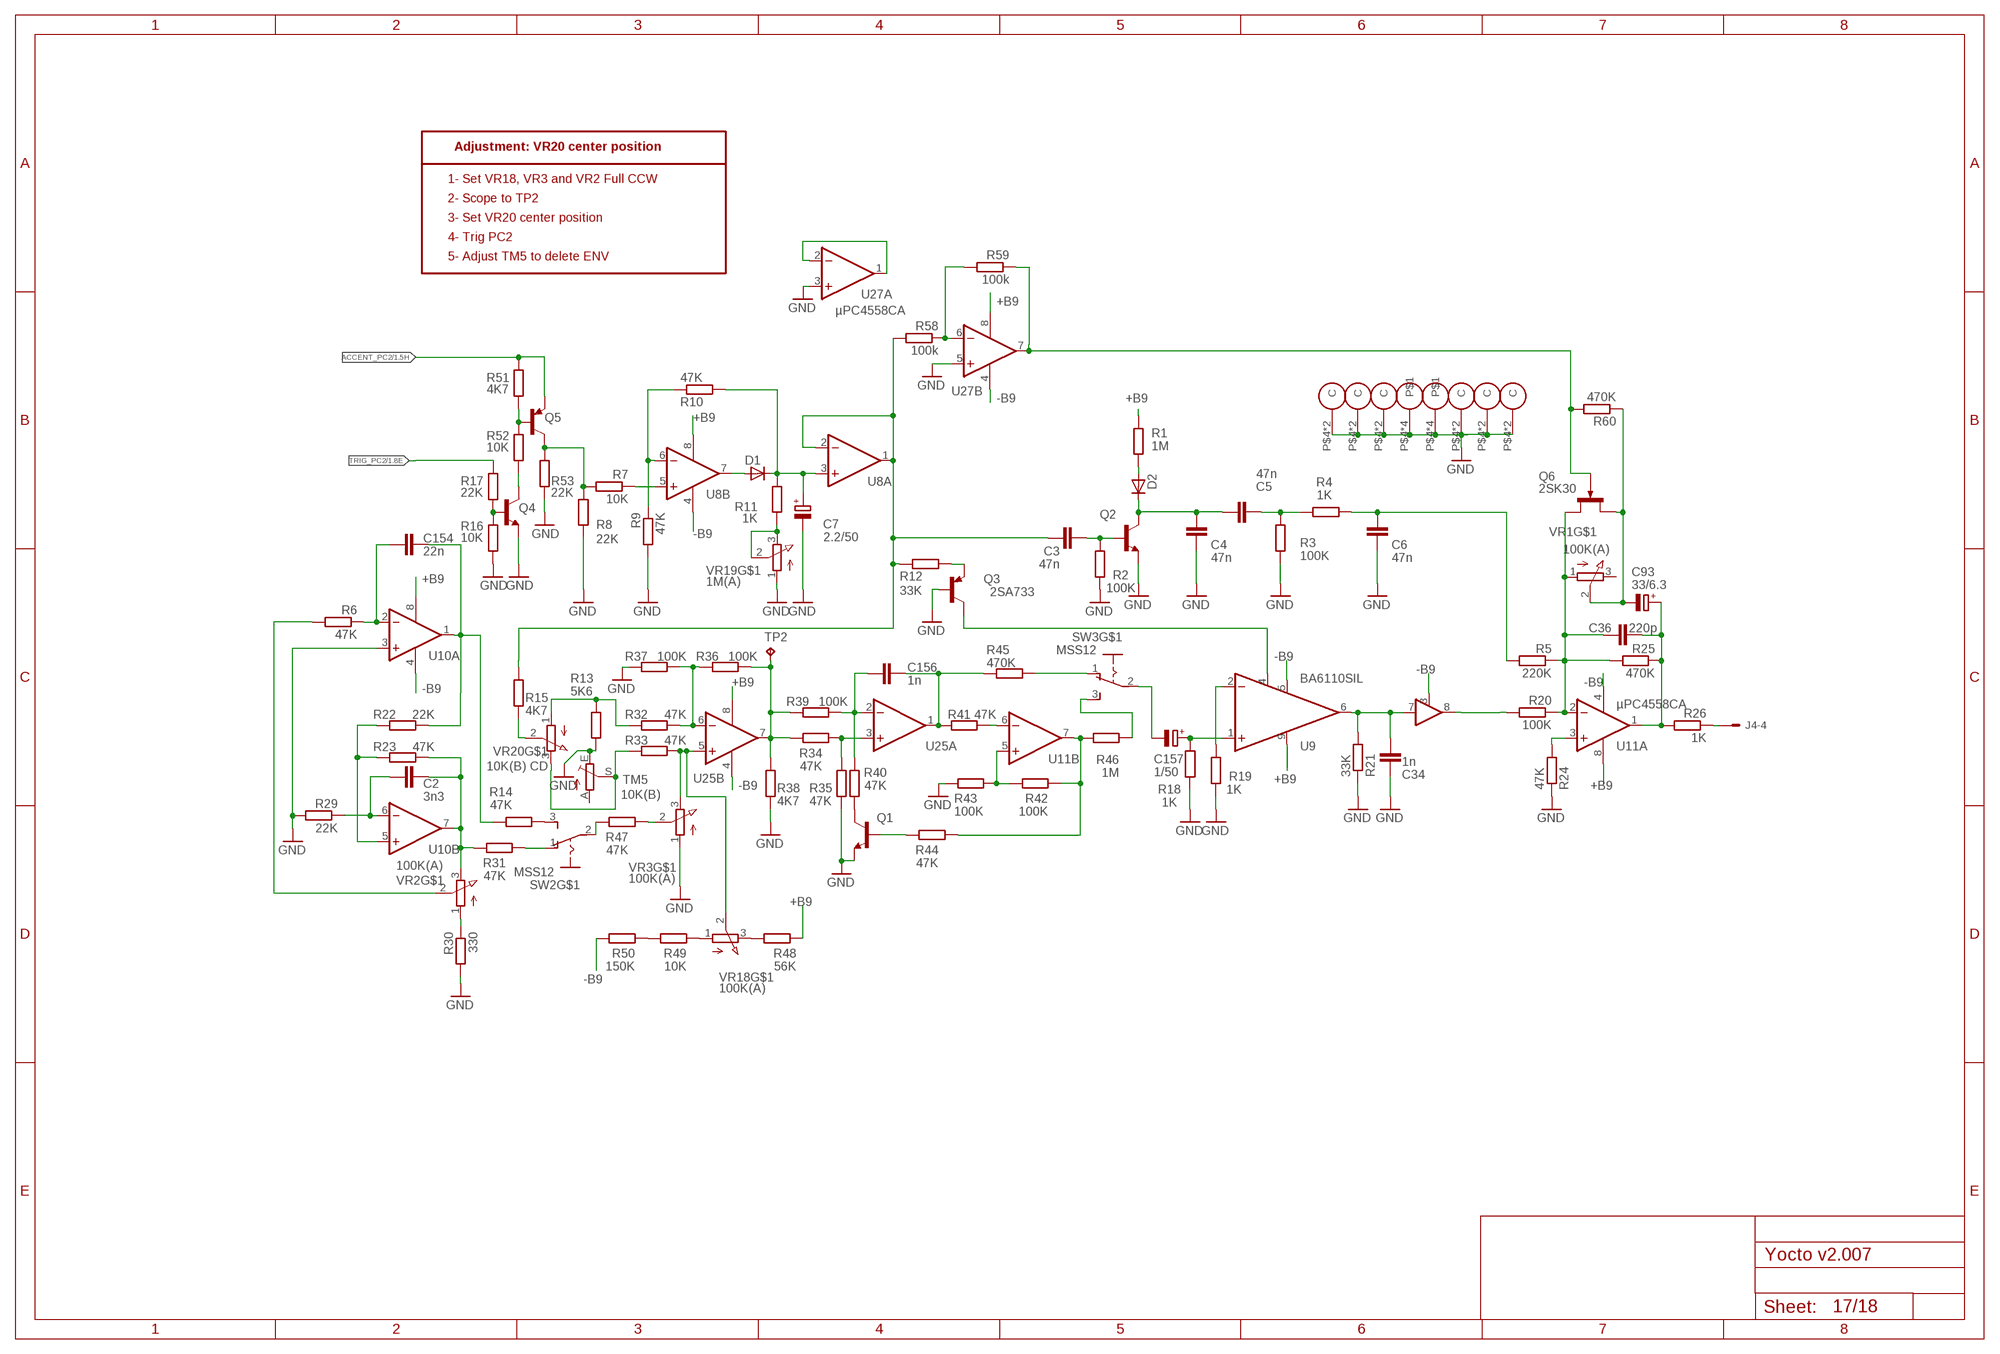
[diagram p17: schematic, sheet 17]

### Parts
C2  3n3  C-EU050-025X075  [C050-025X075]
C3  47n  C-EU050-025X075  [C050-025X075]
C4  47n  C-EU050-025X075  [C050-025X075]
C5  47n  C-EU050-025X075  [C050-025X075]
C6  47n  C-EU050-025X075  [C050-025X075]
C7  2.2/50  CPOL-EUE2-5  [E2-5]
C34  1n  C-EU050-025X075  [C050-025X075]
C36  220p  C-EU025-025X050  [C025-025X050]
C93  33/6.3  CPOL-EUE2-5  [E2-5]
C154  22n  C-EU050-025X075  [C050-025X075]
C156  1n  C-EU050-025X075  [C050-025X075]
C157  1/50  CPOL-EUE2-5  [E2-5]
D1  1N4148  [DO35-7C]
D2  1N4148  [DO35-7C]
Q1  2SC945  [TO-92-ECB-PERSO]
Q2  2SC945  [TO-92-ECB-PERSO]
Q3  2SA733  [TO-92-ECB-MARKED]
Q4  2SC945  [TO-92-ECB-PERSO]
Q5  2SA733  [TO-92-ECB-MARKED]
Q6  2SK30  [TO-92-MARKED_FET]
R1  1M  R-EU_0207/7  [0207/7]
R2  100K  R-EU_0207/7  [0207/7]
R3  100K  R-EU_0207/7  [0207/7]
R4  1K  R-EU_0207/7  [0207/7]
R5  220K  R-EU_0207/7  [0207/7]
R6  47K  R-EU_0207/7  [0207/7]
R7  10K  R-EU_0207/7  [0207/7]
R8  22K  R-EU_0207/7  [0207/7]
R9  47K  R-EU_0207/7  [0207/7]
R10  47K  R-EU_0207/7  [0207/7]
R11  1K  R-EU_0207/7  [0207/7]
R12  33K  R-EU_0207/7  [0207/7]
R13  5K6  R-EU_0207/7  [0207/7]
R14  47K  R-EU_0207/7  [0207/7]
R15  4K7  R-EU_0207/7  [0207/7]
R16  10K  R-EU_0207/7  [0207/7]
R17  22K  R-EU_0207/7  [0207/7]
R18  1K  R-EU_0207/7  [0207/7]
R19  1K  R-EU_0207/7  [0207/7]
R20  100K  R-EU_0207/7  [0207/7]
R21  33K  R-EU_0207/7  [0207/7]
R22  22K  R-EU_0207/7  [0207/7]
R23  47K  R-EU_0207/7  [0207/7]
R24  47K  R-EU_0207/7  [0207/7]
R25  470K  R-EU_0207/7  [0207/7]
R26  1K  R-EU_0207/7  [0207/7]
R29  22K  R-EU_0207/7  [0207/7]
R30  330  R-EU_0207/7  [0207/7]
R31  47K  R-EU_0207/7  [0207/7]
R32  47K  R-EU_0207/7  [0207/7]
R33  47K  R-EU_0207/7  [0207/7]
R34  47K  R-EU_0207/7  [0207/7]
R35  47K  R-EU_0207/7  [0207/7]
R36  100K  R-EU_0207/7  [0207/7]
R37  100K  R-EU_0207/7  [0207/7]
R38  4K7  R-EU_0207/7  [0207/7]
R39  100K  R-EU_0207/7  [0207/7]
R40  47K  R-EU_0207/7  [0207/7]
R41  47K  R-EU_0207/7  [0207/7]
R42  100K  R-EU_0207/7  [0207/7]
R43  100K  R-EU_0207/7  [0207/7]
R44  47K  R-EU_0207/7  [0207/7]
R45  470K  R-EU_0207/7  [0207/7]
R46  1M  R-EU_0207/7  [0207/7]
R47  47K  R-EU_0207/7  [0207/7]
R48  56K  R-EU_0207/7  [0207/7]
R49  10K  R-EU_0207/7  [0207/7]
R50  150K  R-EU_0207/7  [0207/7]
R51  4K7  R-EU_0207/7  [0207/7]
R52  10K  R-EU_0207/7  [0207/7]
R53  22K  R-EU_0207/7  [0207/7]
R58  100k  R-EU_0207/7  [0207/7]
R59  100k  R-EU_0207/7  [0207/7]
R60  470K  R-EU_0207/7  [0207/7]
SW2  MSS12  [MSS12_SW_SLIDE]
SW3  MSS12  [MSS12_SW_SLIDE]
TM5  10K(B)  TRIM_EU-CT6  [CT6]
TP2  TPB0,8  [B0,8]
U8  µPC4558CA  [DIL08]
U9  BA6110SIL  [SIL09]
U10  µPC4558CA  [DIL08]
U11  µPC4558CA  [DIL08]
U25  µPC4558CA  [DIL08]
U27  µPC4558CA  [DIL08]
VR1  100K(A)  POT_8089MM  [R0903N]
VR2  100K(A)  POT_8089MM  [R0903N]
VR3  100K(A)  POT_8089MM  [R0903N]
VR18  100K(A)  POT_8089MM  [R0903N]
VR19  1M(A)  POT_8089MM  [R0903N]
VR20  10K(B) CD  POT_8089MM  [R0903N]

### Nets
+B9 [power]: R1.1 R48.1 U8.8(V+) U9.9(V+) U10.8(V+) U11.8(V+) U25.8(V+) U27.8(V+) ; also sheet 4
-B9 [power]: R50.2 U8.4(V-) U9.3 U9.5(V-) U10.4(V-) U11.4(V-) U25.4(V-) U27.4(V-) ; also sheet 4
ACCENT_PC2: Q5.E R51.2 ; also sheet 1
CP_MA_OUT1: J4.4 R26.1
GND [GND]: C4.1 C6.1 C7.- C34.1 Q1.E Q2.E Q3.B Q4.E R2.2 R3.2 R8.2 R9.2 R13.2 R16.1 R18.1 R19.1 R21.1 R24.1 R29.2 R30.2 R35.2 R37.2 R38.2 R43.1 R53.1 SW2.P$4 SW2.P$5 SW2.P$6 SW2.P$7 SW3.P$4 SW3.P$5 SW3.P$6 SW3.P$7 TM5.E U10.3(A:+IN) U27.3(A:+IN) U27.5(B:+IN) VR1.P$4(C) VR1.P$5(C) VR2.P$4(C) VR2.P$5(C) VR3.1(A) VR3.P$4(C) VR3.P$5(C) VR18.P$4(C) VR18.P$5(C) VR19.1(A) VR19.P$4(C) VR19.P$5(C) VR20.P$4(C) VR20.P$5(C) ; also sheet 1,2,3,4,5,6,7,8,9,10,11,12,13,14,15,16,18
N$288: D1.A U8.7(B:OUT)
N$289: D2.A R1.2
N$290: Q1.C R40.1
N$363: C3.2 Q2.B R2.1
N$364: R24.2 U11.3(A:+IN)
N$365: C4.2 C5.2 D2.C Q2.C
N$366: C5.1 R3.1 R4.1
N$368 [special]: C36.2 Q6.S R5.1 R20.1 R25.2 U11.2(A:-IN) VR1.1(A)
N$369: C6.2 R4.2 R5.2
N$370: Q3.E R12.1
N$371: C36.1 C93.+ R25.1 R26.2 U11.1(A:OUT)
N$372: C7.+ D1.C R10.2 R11.2 U8.3(A:+IN)
N$373: R7.1 U8.5(B:+IN)
N$374: R9.1 R10.1 U8.6(B:-IN)
N$376: R14.1 SW2.3(S)
N$379: C3.1 R12.2 R15.1 R58.2 U8.1(A:OUT) U8.2(A:-IN)
N$380: R11.1 VR19.2(S) VR19.3(E)
N$381: Q3.C U9.4(C)
N$382: R15.2 VR20.2(S)
N$383: R13.1 R32.2 VR20.1(A)
N$384: R19.2 U9.2(-IN)
N$385: C34.2 R21.2 U9.6(OUT) U9.7(IN1)
N$386: R20.2 U9.8(OUT1)
N$387: R33.2 TM5.S VR20.3(E)
N$388: Q5.B R51.1 R52.2
N$389: C157.+ R18.2 U9.1(+IN)
N$390: Q4.B R16.2 R17.1
N$391: Q4.C R52.1
N$393: R34.1 R35.1 U25.3(A:+IN)
N$394: R34.2 R36.1 R38.1 R39.2 TP2.P$1(TP) U25.7(B:OUT)
N$395: R32.1 R36.2 R37.1 U25.6(B:-IN)
N$396: R33.1 U25.5(B:+IN) VR3.3(E) VR18.2(S)
N$397: R41.1 U11.6(B:-IN)
N$398: C156.2 R39.1 R40.2 U25.2(A:-IN)
N$399: R42.2 R43.2 U11.5(B:+IN)
N$400: R47.1 VR3.2(S)
N$401: Q1.B R44.2
N$402: R42.1 R44.1 R46.2 U11.7(B:OUT)
N$403: R47.2 SW2.2(P)
N$404: R30.1 VR2.1(A)
N$405: R49.2 R50.1
N$406: R49.1 VR18.1(A)
N$407: R48.2 VR18.3(E)
N$408: R31.1 SW2.1(O)
N$409: R45.1 SW3.1(O)
N$410: Q5.C R7.2 R8.1 R53.2
N$418: R58.1 R59.2 U27.6(B:-IN)
N$421: U27.1(A:OUT) U27.2(A:-IN)
N$430: Q6.G R59.1 R60.2 U27.7(B:OUT)
N$434: C93.- Q6.D R60.1 VR1.2(S)
N$631: C154.1 R14.2 R22.1 U10.1(A:OUT)
N$632: R22.2 R23.2 U10.5(B:+IN)
N$636: C2.2 R29.1 U10.6(B:-IN)
N$637: C2.1 R23.1 R31.2 U10.7(B:OUT) VR2.3(E)
N$638: C154.2 R6.1 U10.2(A:-IN)
N$644: R6.2 VR2.2(S)
N$683: R46.1 SW3.3(S)
N$684: C156.1 R41.2 R45.2 U25.1(A:OUT)
N$687: C157.- SW3.2(P)
TRIG_PC2: R17.2 ; also sheet 1
Unconnected: TM5.A VR1.3(E)

### Notes on the sheet
- Adjustment: VR20 center position
- 1- Set VR18, VR3 and VR2 Full CCW
- 2- Scope to TP2
- 3- Set VR20 center position
- 4- Trig PC2
- 5- Adjust TM5 to delete ENV